# EAGLE design Decoder16_1 (EAGLE 6.5.0)

## Sheet 1 of 5
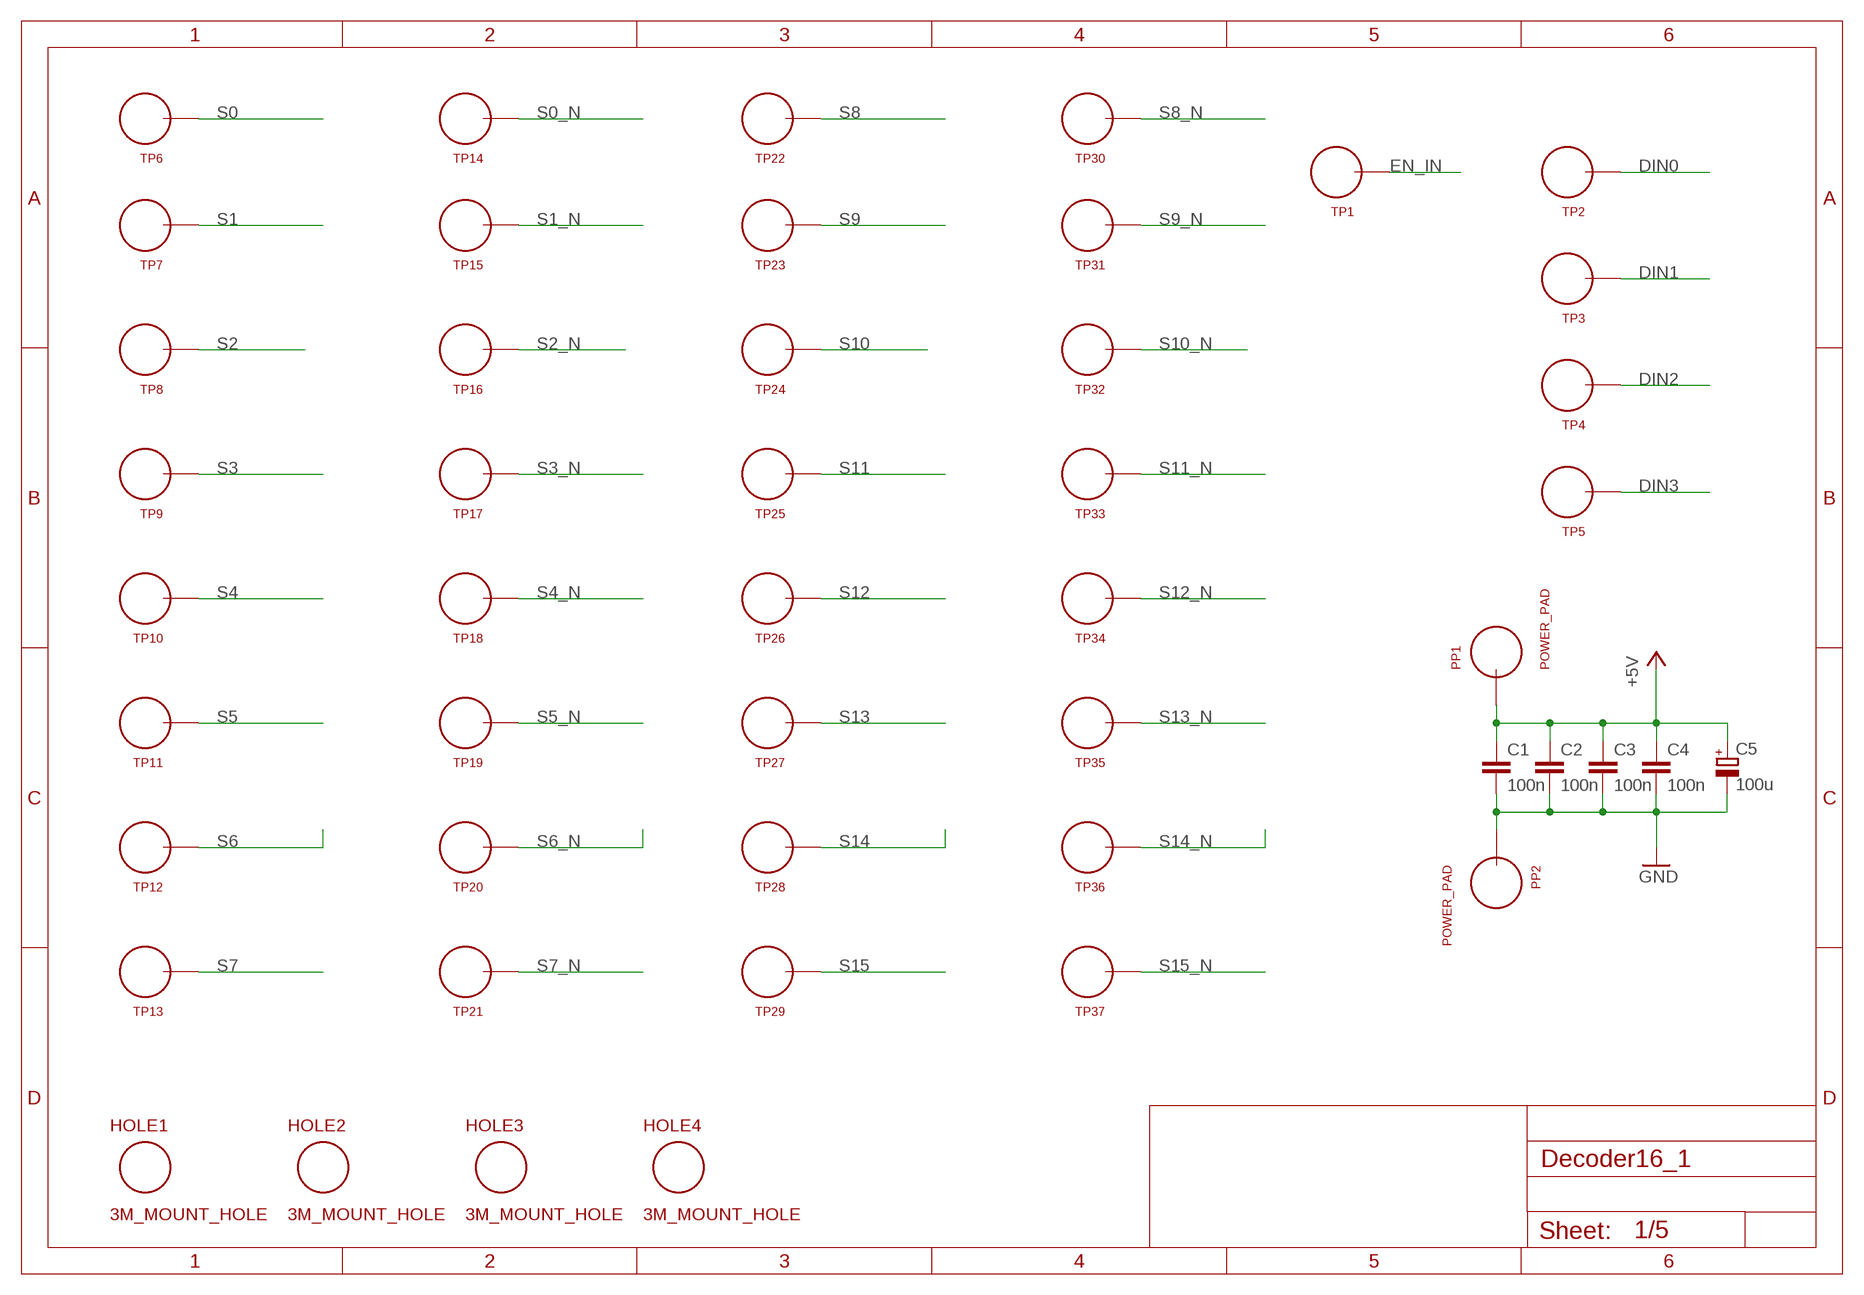
[diagram p0: schematic, sheet 1]

### Parts
C1  100n  C_P2INCH  [CAP_P2INCH]
C2  100n  C_P2INCH  [CAP_P2INCH]
C3  100n  C_P2INCH  [CAP_P2INCH]
C4  100n  C_P2INCH  [CAP_P2INCH]
C5  100u  POLARISED_CAP_2P5_6P3MM  [POLARISED_CAP_2P5_6P3MM]
HOLE1  3M_MOUNT_HOLE  [3M_HOLE]
HOLE2  3M_MOUNT_HOLE  [3M_HOLE]
HOLE3  3M_MOUNT_HOLE  [3M_HOLE]
HOLE4  3M_MOUNT_HOLE  [3M_HOLE]
PP1  POWER_PAD  [POWER_PAD]
PP2  POWER_PAD  [POWER_PAD]
TP1  TEST_LOOP  [TEST_LOOP]
TP2  TEST_LOOP  [TEST_LOOP]
TP3  TEST_LOOP  [TEST_LOOP]
TP4  TEST_LOOP  [TEST_LOOP]
TP5  TEST_LOOP  [TEST_LOOP]
TP6  TEST_LOOP  [TEST_LOOP]
TP7  TEST_LOOP  [TEST_LOOP]
TP8  TEST_LOOP  [TEST_LOOP]
TP9  TEST_LOOP  [TEST_LOOP]
TP10  TEST_LOOP  [TEST_LOOP]
TP11  TEST_LOOP  [TEST_LOOP]
TP12  TEST_LOOP  [TEST_LOOP]
TP13  TEST_LOOP  [TEST_LOOP]
TP14  TEST_LOOP  [TEST_LOOP]
TP15  TEST_LOOP  [TEST_LOOP]
TP16  TEST_LOOP  [TEST_LOOP]
TP17  TEST_LOOP  [TEST_LOOP]
TP18  TEST_LOOP  [TEST_LOOP]
TP19  TEST_LOOP  [TEST_LOOP]
TP20  TEST_LOOP  [TEST_LOOP]
TP21  TEST_LOOP  [TEST_LOOP]
TP22  TEST_LOOP  [TEST_LOOP]
TP23  TEST_LOOP  [TEST_LOOP]
TP24  TEST_LOOP  [TEST_LOOP]
TP25  TEST_LOOP  [TEST_LOOP]
TP26  TEST_LOOP  [TEST_LOOP]
TP27  TEST_LOOP  [TEST_LOOP]
TP28  TEST_LOOP  [TEST_LOOP]
TP29  TEST_LOOP  [TEST_LOOP]
TP30  TEST_LOOP  [TEST_LOOP]
TP31  TEST_LOOP  [TEST_LOOP]
TP32  TEST_LOOP  [TEST_LOOP]
TP33  TEST_LOOP  [TEST_LOOP]
TP34  TEST_LOOP  [TEST_LOOP]
TP35  TEST_LOOP  [TEST_LOOP]
TP36  TEST_LOOP  [TEST_LOOP]
TP37  TEST_LOOP  [TEST_LOOP]

### Nets
+5V: C1.1 C2.1 C3.1 C4.1 C5.A PP1.1 ; also sheet 2,3,4,5
DIN0: TP2.P$1 ; also sheet 2
DIN1: TP3.P$1 ; also sheet 2
DIN2: TP4.P$1 ; also sheet 2
DIN3: TP5.P$1 ; also sheet 2
EN_IN: TP1.P$1 ; also sheet 2
GND: C1.2 C2.2 C3.2 C4.2 C5.K PP2.1 ; also sheet 2,3,4,5
S0: TP6.P$1 ; also sheet 5
S0_N: TP14.P$1 ; also sheet 3,5
S1: TP7.P$1 ; also sheet 5
S1_N: TP15.P$1 ; also sheet 3,5
S2: TP8.P$1 ; also sheet 5
S2_N: TP16.P$1 ; also sheet 3,5
S3: TP9.P$1 ; also sheet 5
S3_N: TP17.P$1 ; also sheet 3,5
S4: TP10.P$1 ; also sheet 5
S4_N: TP18.P$1 ; also sheet 3,5
S5: TP11.P$1 ; also sheet 5
S5_N: TP19.P$1 ; also sheet 3,5
S6: TP12.P$1 ; also sheet 5
S6_N: TP20.P$1 ; also sheet 3,5
S7: TP13.P$1 ; also sheet 5
S7_N: TP21.P$1 ; also sheet 3,5
S8: TP22.P$1 ; also sheet 5
S8_N: TP30.P$1 ; also sheet 4,5
S9: TP23.P$1 ; also sheet 5
S9_N: TP31.P$1 ; also sheet 4,5
S10: TP24.P$1 ; also sheet 5
S10_N: TP32.P$1 ; also sheet 4,5
S11: TP25.P$1 ; also sheet 5
S11_N: TP33.P$1 ; also sheet 4,5
S12: TP26.P$1 ; also sheet 5
S12_N: TP34.P$1 ; also sheet 4,5
S13: TP27.P$1 ; also sheet 5
S13_N: TP35.P$1 ; also sheet 4,5
S14: TP28.P$1 ; also sheet 5
S14_N: TP36.P$1 ; also sheet 4,5
S15: TP29.P$1 ; also sheet 5
S15_N: TP37.P$1 ; also sheet 4,5

## Sheet 2 of 5
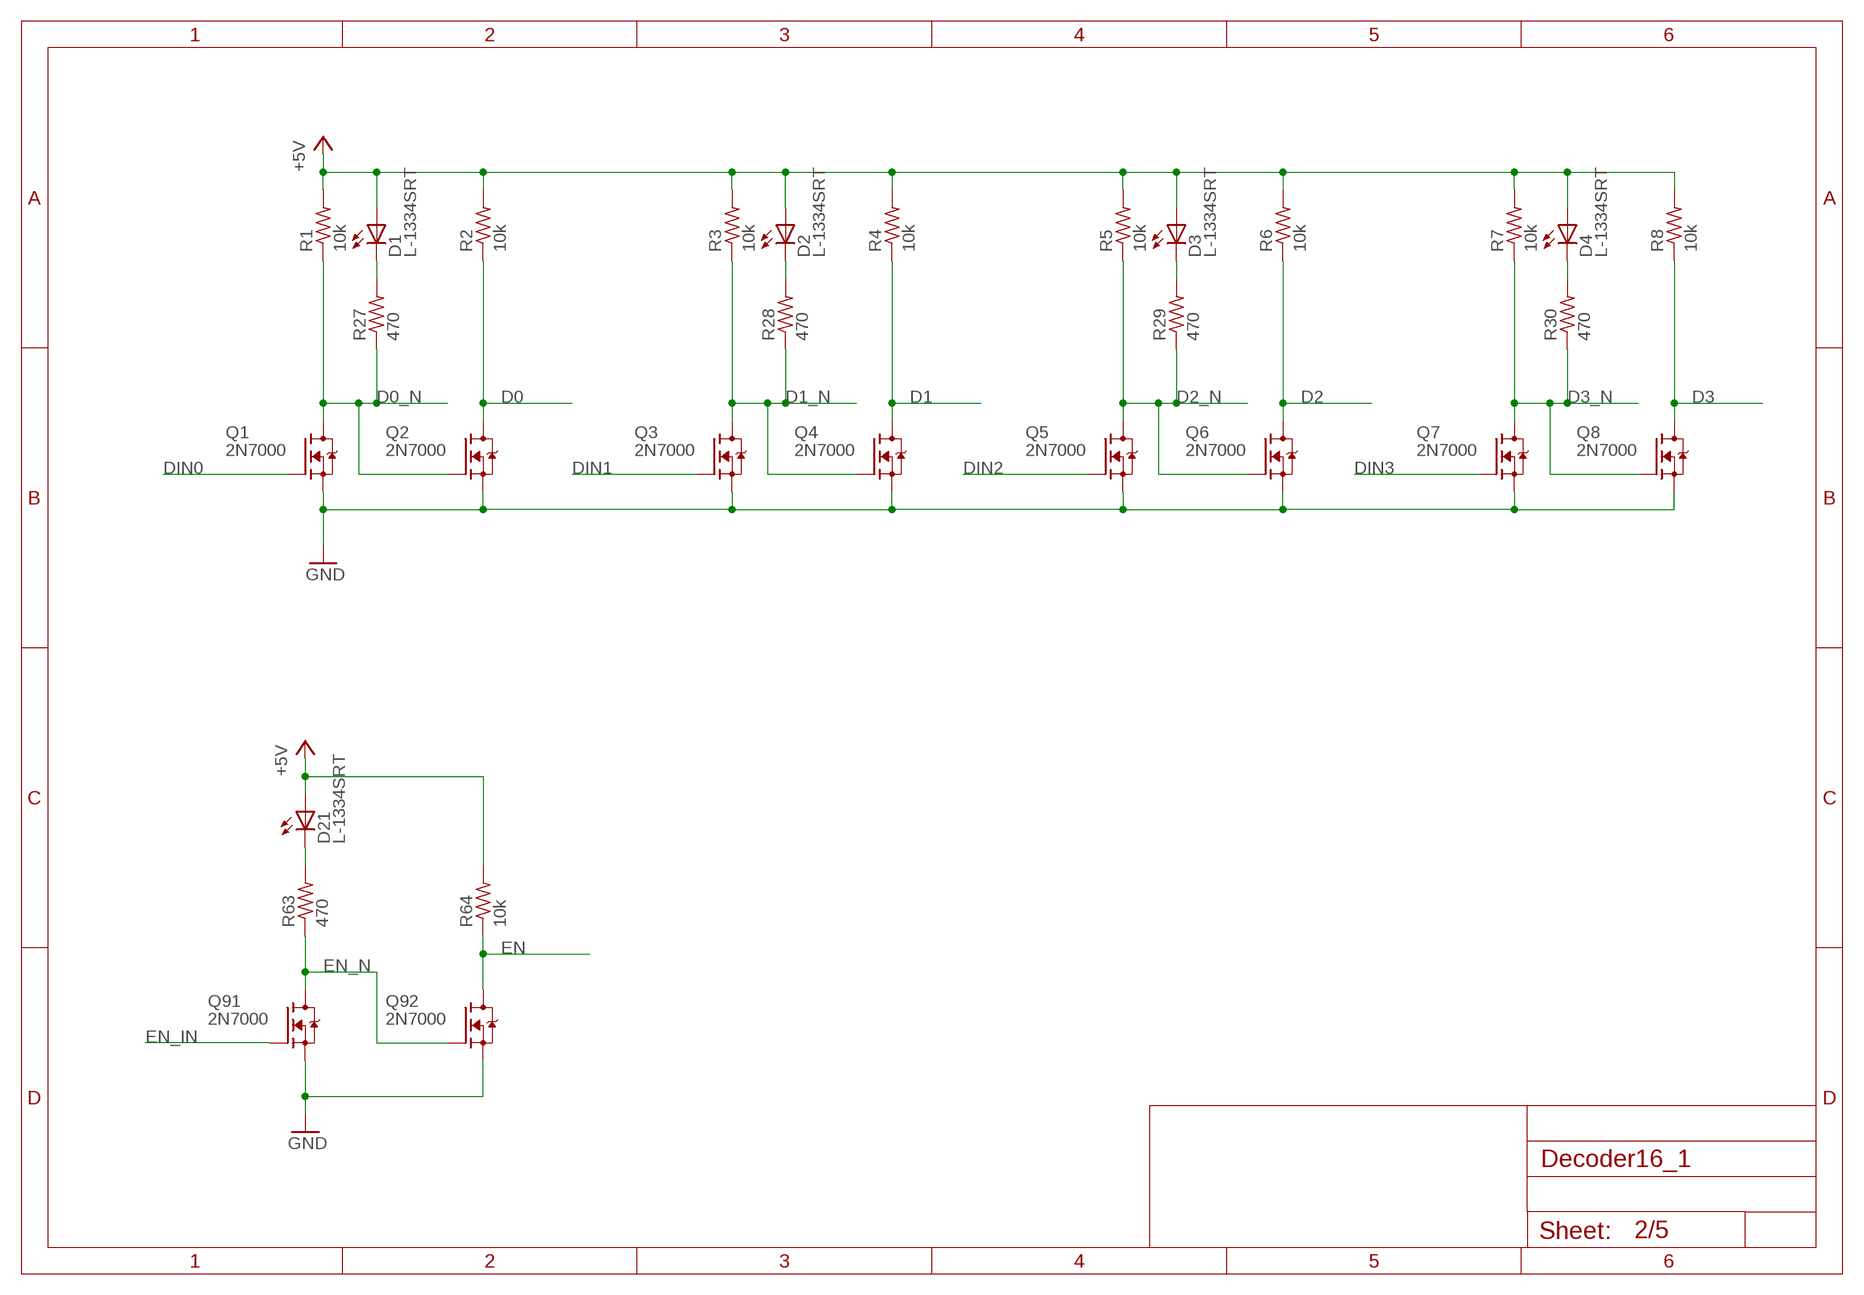
[diagram p1: schematic, sheet 2]

### Parts
D1  L-1334SRT  [LED3MM]
D2  L-1334SRT  [LED3MM]
D3  L-1334SRT  [LED3MM]
D4  L-1334SRT  [LED3MM]
D21  L-1334SRT  [LED3MM]
Q1  2N7000  [TO92-DGS]
Q2  2N7000  [TO92-DGS]
Q3  2N7000  [TO92-DGS]
Q4  2N7000  [TO92-DGS]
Q5  2N7000  [TO92-DGS]
Q6  2N7000  [TO92-DGS]
Q7  2N7000  [TO92-DGS]
Q8  2N7000  [TO92-DGS]
Q91  2N7000  [TO92-DGS]
Q92  2N7000  [TO92-DGS]
R1  10k  R_P2INCH  [R_P2INCH]
R2  10k  R_P2INCH  [R_P2INCH]
R3  10k  R_P2INCH  [R_P2INCH]
R4  10k  R_P2INCH  [R_P2INCH]
R5  10k  R_P2INCH  [R_P2INCH]
R6  10k  R_P2INCH  [R_P2INCH]
R7  10k  R_P2INCH  [R_P2INCH]
R8  10k  R_P2INCH  [R_P2INCH]
R27  470  R_P2INCH  [R_P2INCH]
R28  470  R_P2INCH  [R_P2INCH]
R29  470  R_P2INCH  [R_P2INCH]
R30  470  R_P2INCH  [R_P2INCH]
R63  470  R_P2INCH  [R_P2INCH]
R64  10k  R_P2INCH  [R_P2INCH]

### Nets
+5V: D1.A D2.A D3.A D4.A D21.A R1.2 R2.2 R3.2 R4.2 R5.2 R6.2 R7.2 R8.2 R64.2 ; also sheet 1,3,4,5
D0: Q2.D R2.1 ; also sheet 3,4
D0_N: Q1.D Q2.G R1.1 R27.1 ; also sheet 3,4
D1: Q4.D R4.1 ; also sheet 3,4
D1_N: Q3.D Q4.G R3.1 R28.1 ; also sheet 3,4
D2: Q6.D R6.1 ; also sheet 3,4
D2_N: Q5.D Q6.G R5.1 R29.1 ; also sheet 3,4
D3: Q8.D R8.1 ; also sheet 4
D3_N: Q7.D Q8.G R7.1 R30.1 ; also sheet 3
DIN0: Q1.G ; also sheet 1
DIN1: Q3.G ; also sheet 1
DIN2: Q5.G ; also sheet 1
DIN3: Q7.G ; also sheet 1
EN: Q92.D R64.1 ; also sheet 3,4
EN_IN: Q91.G ; also sheet 1
EN_N: Q91.D Q92.G R63.1
GND: Q1.S Q2.S Q3.S Q4.S Q5.S Q6.S Q7.S Q8.S Q91.S Q92.S ; also sheet 1,3,4,5
N$51: D1.K(C) R27.2
N$52: D2.K(C) R28.2
N$53: D3.K(C) R29.2
N$54: D4.K(C) R30.2
N$71: D21.K(C) R63.2

## Sheet 3 of 5
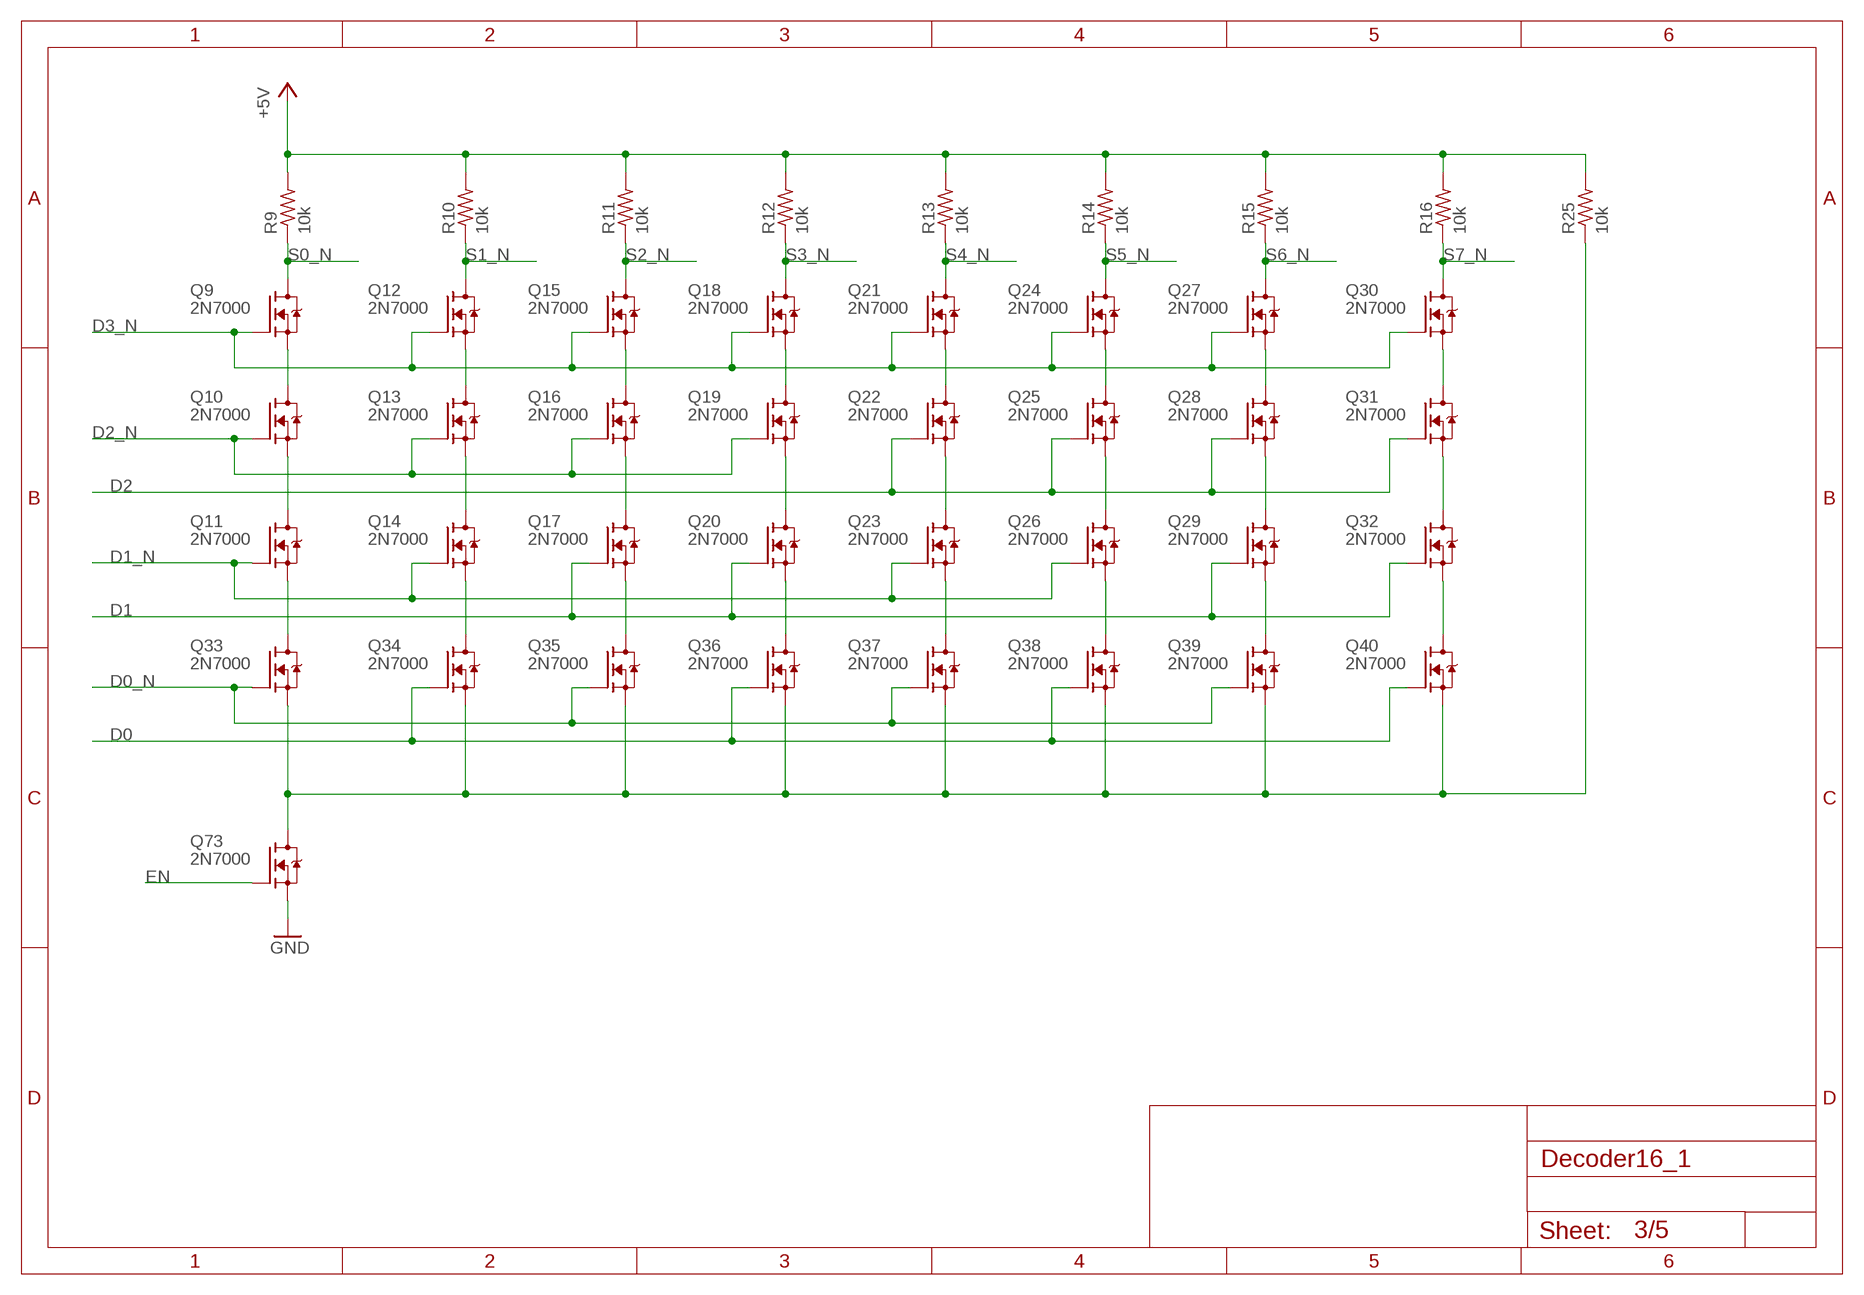
[diagram p2: schematic, sheet 3]

### Parts
Q9  2N7000  [TO92-DGS]
Q10  2N7000  [TO92-DGS]
Q11  2N7000  [TO92-DGS]
Q12  2N7000  [TO92-DGS]
Q13  2N7000  [TO92-DGS]
Q14  2N7000  [TO92-DGS]
Q15  2N7000  [TO92-DGS]
Q16  2N7000  [TO92-DGS]
Q17  2N7000  [TO92-DGS]
Q18  2N7000  [TO92-DGS]
Q19  2N7000  [TO92-DGS]
Q20  2N7000  [TO92-DGS]
Q21  2N7000  [TO92-DGS]
Q22  2N7000  [TO92-DGS]
Q23  2N7000  [TO92-DGS]
Q24  2N7000  [TO92-DGS]
Q25  2N7000  [TO92-DGS]
Q26  2N7000  [TO92-DGS]
Q27  2N7000  [TO92-DGS]
Q28  2N7000  [TO92-DGS]
Q29  2N7000  [TO92-DGS]
Q30  2N7000  [TO92-DGS]
Q31  2N7000  [TO92-DGS]
Q32  2N7000  [TO92-DGS]
Q33  2N7000  [TO92-DGS]
Q34  2N7000  [TO92-DGS]
Q35  2N7000  [TO92-DGS]
Q36  2N7000  [TO92-DGS]
Q37  2N7000  [TO92-DGS]
Q38  2N7000  [TO92-DGS]
Q39  2N7000  [TO92-DGS]
Q40  2N7000  [TO92-DGS]
Q73  2N7000  [TO92-DGS]
R9  10k  R_P2INCH  [R_P2INCH]
R10  10k  R_P2INCH  [R_P2INCH]
R11  10k  R_P2INCH  [R_P2INCH]
R12  10k  R_P2INCH  [R_P2INCH]
R13  10k  R_P2INCH  [R_P2INCH]
R14  10k  R_P2INCH  [R_P2INCH]
R15  10k  R_P2INCH  [R_P2INCH]
R16  10k  R_P2INCH  [R_P2INCH]
R25  10k  R_P2INCH  [R_P2INCH]

### Nets
+5V: R9.2 R10.2 R11.2 R12.2 R13.2 R14.2 R15.2 R16.2 R25.2 ; also sheet 1,2,4,5
D0: Q34.G Q36.G Q38.G Q40.G ; also sheet 2,4
D0_N: Q33.G Q35.G Q37.G Q39.G ; also sheet 2,4
D1: Q17.G Q20.G Q29.G Q32.G ; also sheet 2,4
D1_N: Q11.G Q14.G Q23.G Q26.G ; also sheet 2,4
D2: Q22.G Q25.G Q28.G Q31.G ; also sheet 2,4
D2_N: Q10.G Q13.G Q16.G Q19.G ; also sheet 2,4
D3_N: Q9.G Q12.G Q15.G Q18.G Q21.G Q24.G Q27.G Q30.G ; also sheet 2
EN: Q73.G ; also sheet 2,4
GND: Q73.S ; also sheet 1,2,4,5
N$2: Q9.S Q10.D
N$3: Q10.S Q11.D
N$4: Q12.S Q13.D
N$5: Q13.S Q14.D
N$6: Q15.S Q16.D
N$7: Q16.S Q17.D
N$8: Q18.S Q19.D
N$9: Q19.S Q20.D
N$10: Q21.S Q22.D
N$11: Q22.S Q23.D
N$12: Q24.S Q25.D
N$13: Q25.S Q26.D
N$14: Q27.S Q28.D
N$15: Q28.S Q29.D
N$16: Q30.S Q31.D
N$17: Q31.S Q32.D
N$19: Q11.S Q33.D
N$21: Q14.S Q34.D
N$22: Q17.S Q35.D
N$23: Q20.S Q36.D
N$24: Q23.S Q37.D
N$25: Q26.S Q38.D
N$26: Q29.S Q39.D
N$27: Q32.S Q40.D
N$49: Q33.S Q34.S Q35.S Q36.S Q37.S Q38.S Q39.S Q40.S Q73.D R25.1
S0_N: Q9.D R9.1 ; also sheet 1,5
S1_N: Q12.D R10.1 ; also sheet 1,5
S2_N: Q15.D R11.1 ; also sheet 1,5
S3_N: Q18.D R12.1 ; also sheet 1,5
S4_N: Q21.D R13.1 ; also sheet 1,5
S5_N: Q24.D R14.1 ; also sheet 1,5
S6_N: Q27.D R15.1 ; also sheet 1,5
S7_N: Q30.D R16.1 ; also sheet 1,5

## Sheet 4 of 5
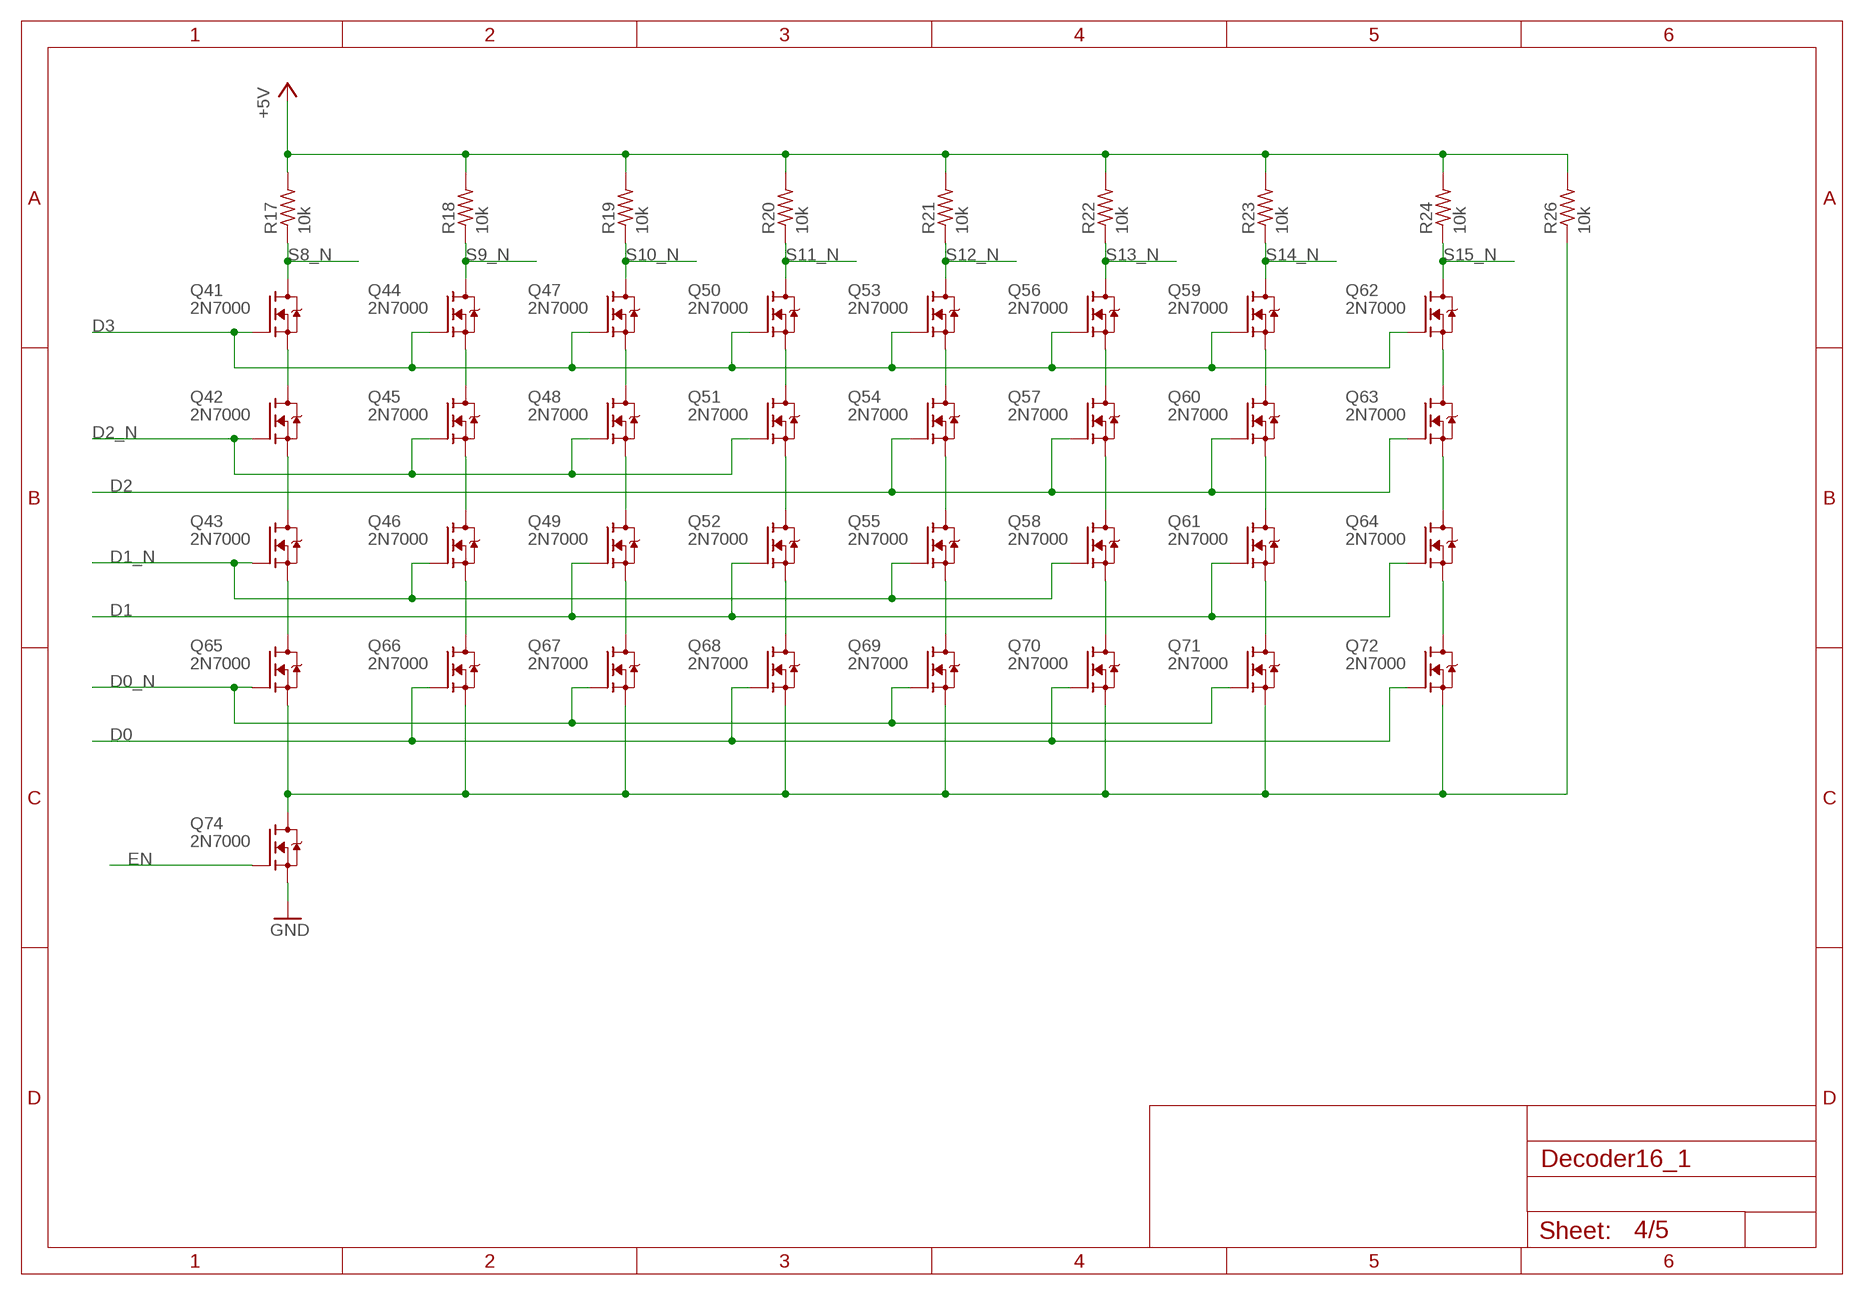
[diagram p3: schematic, sheet 4]

### Parts
Q41  2N7000  [TO92-DGS]
Q42  2N7000  [TO92-DGS]
Q43  2N7000  [TO92-DGS]
Q44  2N7000  [TO92-DGS]
Q45  2N7000  [TO92-DGS]
Q46  2N7000  [TO92-DGS]
Q47  2N7000  [TO92-DGS]
Q48  2N7000  [TO92-DGS]
Q49  2N7000  [TO92-DGS]
Q50  2N7000  [TO92-DGS]
Q51  2N7000  [TO92-DGS]
Q52  2N7000  [TO92-DGS]
Q53  2N7000  [TO92-DGS]
Q54  2N7000  [TO92-DGS]
Q55  2N7000  [TO92-DGS]
Q56  2N7000  [TO92-DGS]
Q57  2N7000  [TO92-DGS]
Q58  2N7000  [TO92-DGS]
Q59  2N7000  [TO92-DGS]
Q60  2N7000  [TO92-DGS]
Q61  2N7000  [TO92-DGS]
Q62  2N7000  [TO92-DGS]
Q63  2N7000  [TO92-DGS]
Q64  2N7000  [TO92-DGS]
Q65  2N7000  [TO92-DGS]
Q66  2N7000  [TO92-DGS]
Q67  2N7000  [TO92-DGS]
Q68  2N7000  [TO92-DGS]
Q69  2N7000  [TO92-DGS]
Q70  2N7000  [TO92-DGS]
Q71  2N7000  [TO92-DGS]
Q72  2N7000  [TO92-DGS]
Q74  2N7000  [TO92-DGS]
R17  10k  R_P2INCH  [R_P2INCH]
R18  10k  R_P2INCH  [R_P2INCH]
R19  10k  R_P2INCH  [R_P2INCH]
R20  10k  R_P2INCH  [R_P2INCH]
R21  10k  R_P2INCH  [R_P2INCH]
R22  10k  R_P2INCH  [R_P2INCH]
R23  10k  R_P2INCH  [R_P2INCH]
R24  10k  R_P2INCH  [R_P2INCH]
R26  10k  R_P2INCH  [R_P2INCH]

### Nets
+5V: R17.2 R18.2 R19.2 R20.2 R21.2 R22.2 R23.2 R24.2 R26.2 ; also sheet 1,2,3,5
D0: Q66.G Q68.G Q70.G Q72.G ; also sheet 2,3
D0_N: Q65.G Q67.G Q69.G Q71.G ; also sheet 2,3
D1: Q49.G Q52.G Q61.G Q64.G ; also sheet 2,3
D1_N: Q43.G Q46.G Q55.G Q58.G ; also sheet 2,3
D2: Q54.G Q57.G Q60.G Q63.G ; also sheet 2,3
D2_N: Q42.G Q45.G Q48.G Q51.G ; also sheet 2,3
D3: Q41.G Q44.G Q47.G Q50.G Q53.G Q56.G Q59.G Q62.G ; also sheet 2
EN: Q74.G ; also sheet 2,3
GND: Q74.S ; also sheet 1,2,3,5
N$1: Q41.S Q42.D
N$18: Q42.S Q43.D
N$20: Q44.S Q45.D
N$28: Q45.S Q46.D
N$29: Q47.S Q48.D
N$30: Q48.S Q49.D
N$31: Q50.S Q51.D
N$32: Q51.S Q52.D
N$33: Q53.S Q54.D
N$34: Q54.S Q55.D
N$35: Q56.S Q57.D
N$36: Q57.S Q58.D
N$37: Q59.S Q60.D
N$38: Q60.S Q61.D
N$39: Q62.S Q63.D
N$40: Q63.S Q64.D
N$41: Q43.S Q65.D
N$42: Q46.S Q66.D
N$43: Q49.S Q67.D
N$44: Q52.S Q68.D
N$45: Q55.S Q69.D
N$46: Q58.S Q70.D
N$47: Q61.S Q71.D
N$48: Q64.S Q72.D
N$50: Q65.S Q66.S Q67.S Q68.S Q69.S Q70.S Q71.S Q72.S Q74.D R26.1
S8_N: Q41.D R17.1 ; also sheet 1,5
S9_N: Q44.D R18.1 ; also sheet 1,5
S10_N: Q47.D R19.1 ; also sheet 1,5
S11_N: Q50.D R20.1 ; also sheet 1,5
S12_N: Q53.D R21.1 ; also sheet 1,5
S13_N: Q56.D R22.1 ; also sheet 1,5
S14_N: Q59.D R23.1 ; also sheet 1,5
S15_N: Q62.D R24.1 ; also sheet 1,5

## Sheet 5 of 5
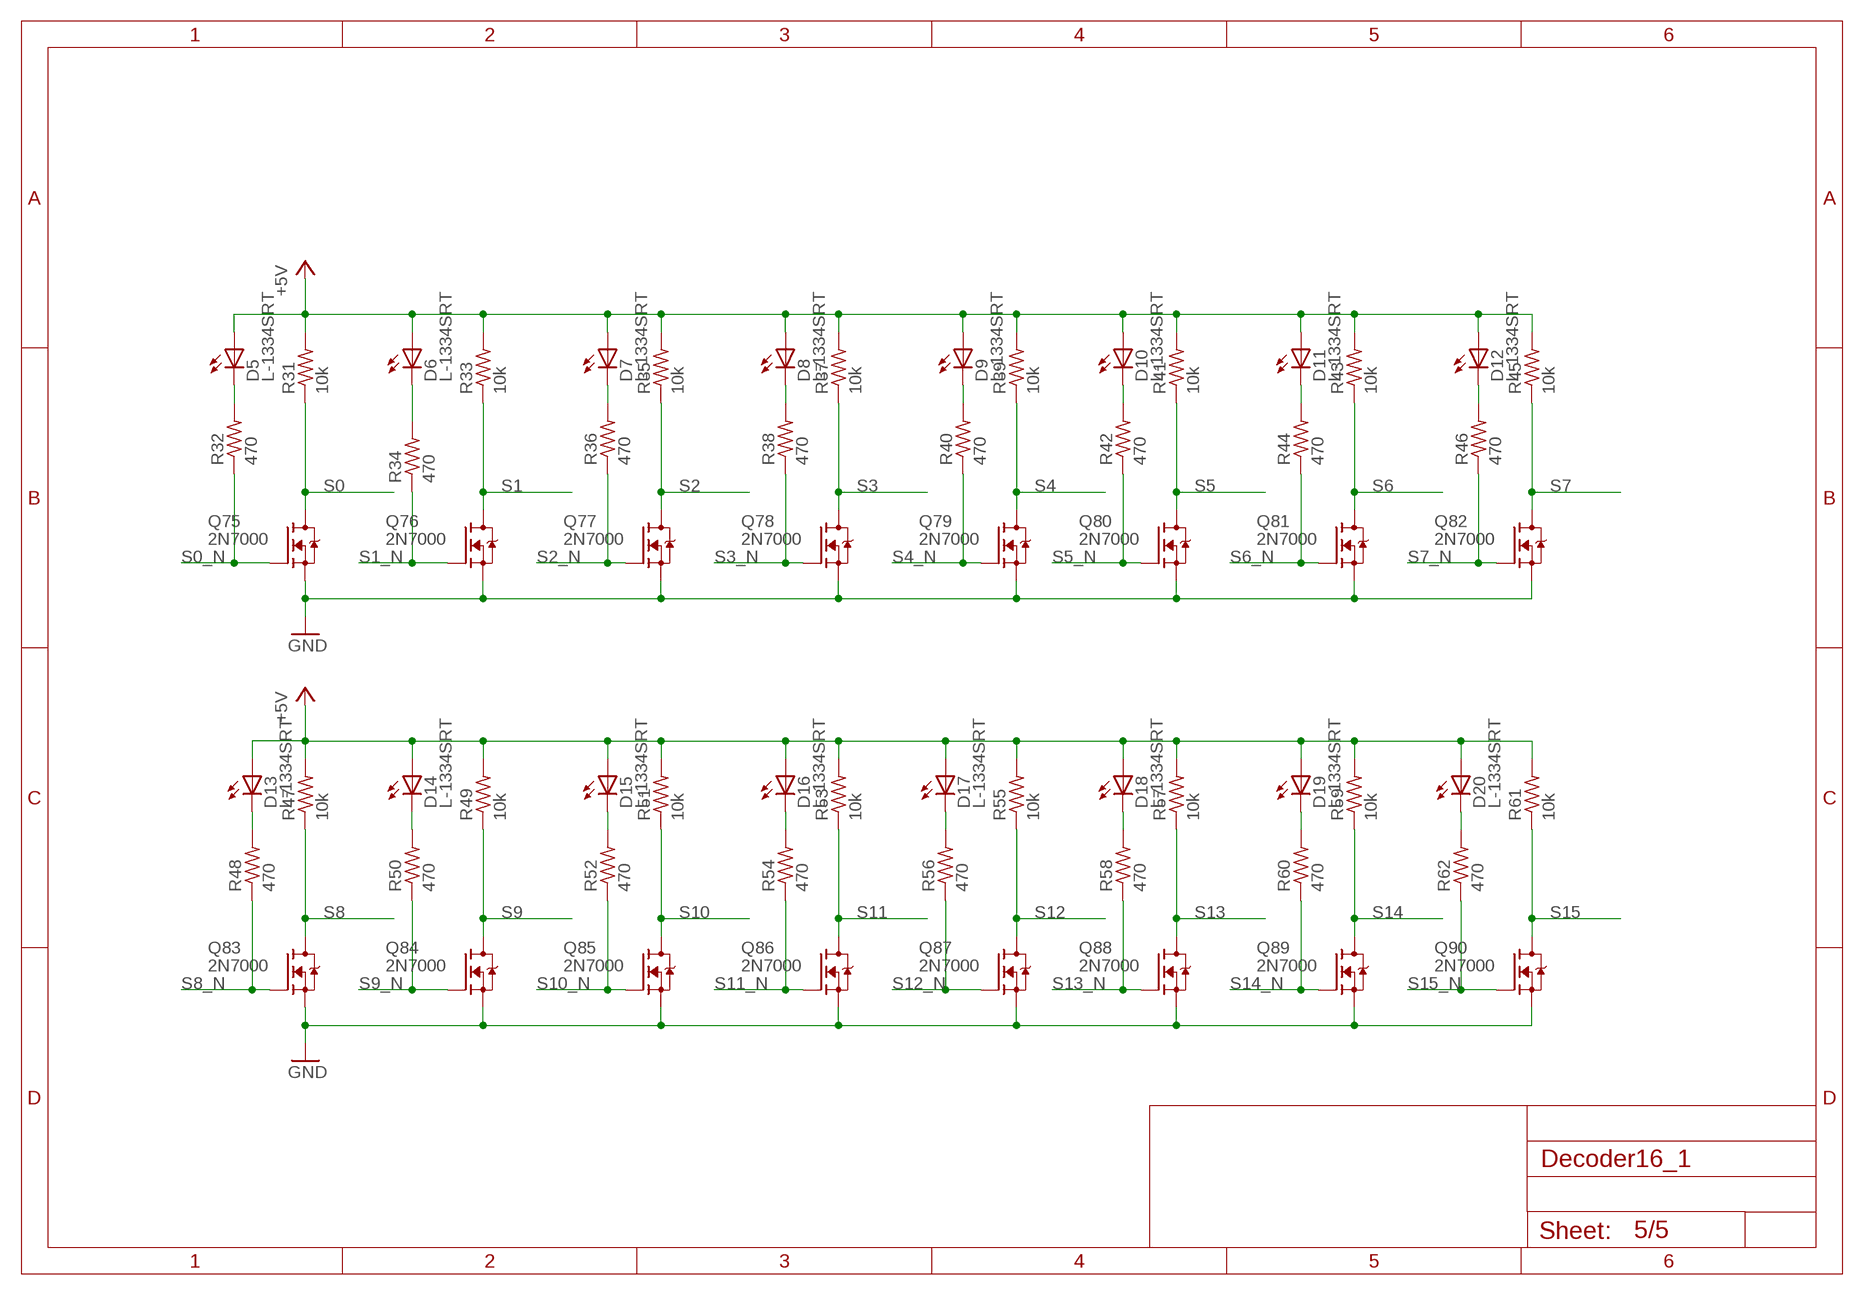
[diagram p4: schematic, sheet 5]

### Parts
D5  L-1334SRT  [LED3MM]
D6  L-1334SRT  [LED3MM]
D7  L-1334SRT  [LED3MM]
D8  L-1334SRT  [LED3MM]
D9  L-1334SRT  [LED3MM]
D10  L-1334SRT  [LED3MM]
D11  L-1334SRT  [LED3MM]
D12  L-1334SRT  [LED3MM]
D13  L-1334SRT  [LED3MM]
D14  L-1334SRT  [LED3MM]
D15  L-1334SRT  [LED3MM]
D16  L-1334SRT  [LED3MM]
D17  L-1334SRT  [LED3MM]
D18  L-1334SRT  [LED3MM]
D19  L-1334SRT  [LED3MM]
D20  L-1334SRT  [LED3MM]
Q75  2N7000  [TO92-DGS]
Q76  2N7000  [TO92-DGS]
Q77  2N7000  [TO92-DGS]
Q78  2N7000  [TO92-DGS]
Q79  2N7000  [TO92-DGS]
Q80  2N7000  [TO92-DGS]
Q81  2N7000  [TO92-DGS]
Q82  2N7000  [TO92-DGS]
Q83  2N7000  [TO92-DGS]
Q84  2N7000  [TO92-DGS]
Q85  2N7000  [TO92-DGS]
Q86  2N7000  [TO92-DGS]
Q87  2N7000  [TO92-DGS]
Q88  2N7000  [TO92-DGS]
Q89  2N7000  [TO92-DGS]
Q90  2N7000  [TO92-DGS]
R31  10k  R_P2INCH  [R_P2INCH]
R32  470  R_P2INCH  [R_P2INCH]
R33  10k  R_P2INCH  [R_P2INCH]
R34  470  R_P2INCH  [R_P2INCH]
R35  10k  R_P2INCH  [R_P2INCH]
R36  470  R_P2INCH  [R_P2INCH]
R37  10k  R_P2INCH  [R_P2INCH]
R38  470  R_P2INCH  [R_P2INCH]
R39  10k  R_P2INCH  [R_P2INCH]
R40  470  R_P2INCH  [R_P2INCH]
R41  10k  R_P2INCH  [R_P2INCH]
R42  470  R_P2INCH  [R_P2INCH]
R43  10k  R_P2INCH  [R_P2INCH]
R44  470  R_P2INCH  [R_P2INCH]
R45  10k  R_P2INCH  [R_P2INCH]
R46  470  R_P2INCH  [R_P2INCH]
R47  10k  R_P2INCH  [R_P2INCH]
R48  470  R_P2INCH  [R_P2INCH]
R49  10k  R_P2INCH  [R_P2INCH]
R50  470  R_P2INCH  [R_P2INCH]
R51  10k  R_P2INCH  [R_P2INCH]
R52  470  R_P2INCH  [R_P2INCH]
R53  10k  R_P2INCH  [R_P2INCH]
R54  470  R_P2INCH  [R_P2INCH]
R55  10k  R_P2INCH  [R_P2INCH]
R56  470  R_P2INCH  [R_P2INCH]
R57  10k  R_P2INCH  [R_P2INCH]
R58  470  R_P2INCH  [R_P2INCH]
R59  10k  R_P2INCH  [R_P2INCH]
R60  470  R_P2INCH  [R_P2INCH]
R61  10k  R_P2INCH  [R_P2INCH]
R62  470  R_P2INCH  [R_P2INCH]

### Nets
+5V: D5.A D6.A D7.A D8.A D9.A D10.A D11.A D12.A D13.A D14.A D15.A D16.A D17.A D18.A D19.A D20.A R31.2 R33.2 R35.2 R37.2 R39.2 R41.2 R43.2 R45.2 R47.2 R49.2 R51.2 R53.2 R55.2 R57.2 R59.2 R61.2 ; also sheet 1,2,3,4
GND: Q75.S Q76.S Q77.S Q78.S Q79.S Q80.S Q81.S Q82.S Q83.S Q84.S Q85.S Q86.S Q87.S Q88.S Q89.S Q90.S ; also sheet 1,2,3,4
N$55: D5.K(C) R32.2
N$56: D13.K(C) R48.2
N$57: D6.K(C) R34.2
N$58: D14.K(C) R50.2
N$59: D7.K(C) R36.2
N$60: D15.K(C) R52.2
N$61: D8.K(C) R38.2
N$62: D16.K(C) R54.2
N$63: D9.K(C) R40.2
N$64: D17.K(C) R56.2
N$65: D10.K(C) R42.2
N$66: D18.K(C) R58.2
N$67: D11.K(C) R44.2
N$68: D19.K(C) R60.2
N$69: D12.K(C) R46.2
N$70: D20.K(C) R62.2
S0: Q75.D R31.1 ; also sheet 1
S0_N: Q75.G R32.1 ; also sheet 1,3
S1: Q76.D R33.1 ; also sheet 1
S1_N: Q76.G R34.1 ; also sheet 1,3
S2: Q77.D R35.1 ; also sheet 1
S2_N: Q77.G R36.1 ; also sheet 1,3
S3: Q78.D R37.1 ; also sheet 1
S3_N: Q78.G R38.1 ; also sheet 1,3
S4: Q79.D R39.1 ; also sheet 1
S4_N: Q79.G R40.1 ; also sheet 1,3
S5: Q80.D R41.1 ; also sheet 1
S5_N: Q80.G R42.1 ; also sheet 1,3
S6: Q81.D R43.1 ; also sheet 1
S6_N: Q81.G R44.1 ; also sheet 1,3
S7: Q82.D R45.1 ; also sheet 1
S7_N: Q82.G R46.1 ; also sheet 1,3
S8: Q83.D R47.1 ; also sheet 1
S8_N: Q83.G R48.1 ; also sheet 1,4
S9: Q84.D R49.1 ; also sheet 1
S9_N: Q84.G R50.1 ; also sheet 1,4
S10: Q85.D R51.1 ; also sheet 1
S10_N: Q85.G R52.1 ; also sheet 1,4
S11: Q86.D R53.1 ; also sheet 1
S11_N: Q86.G R54.1 ; also sheet 1,4
S12: Q87.D R55.1 ; also sheet 1
S12_N: Q87.G R56.1 ; also sheet 1,4
S13: Q88.D R57.1 ; also sheet 1
S13_N: Q88.G R58.1 ; also sheet 1,4
S14: Q89.D R59.1 ; also sheet 1
S14_N: Q89.G R60.1 ; also sheet 1,4
S15: Q90.D R61.1 ; also sheet 1
S15_N: Q90.G R62.1 ; also sheet 1,4

## Library data of the parts
C1-C4 = MyLib:C_P2INCH
C5 = MyLib:POLARISED_CAP_2P5_6P3MM
D1-D21 = MyLib:L-1334SRT
HOLE1-HOLE4 = MyLib:3M_MOUNT_HOLE
PP1 PP2 = MyLib:POWER_PAD
Q1-Q92 = MyLib:2N7000
R1-R64 = MyLib:R_P2INCH
TP1-TP37 = MyLib:TEST_LOOP

## Board
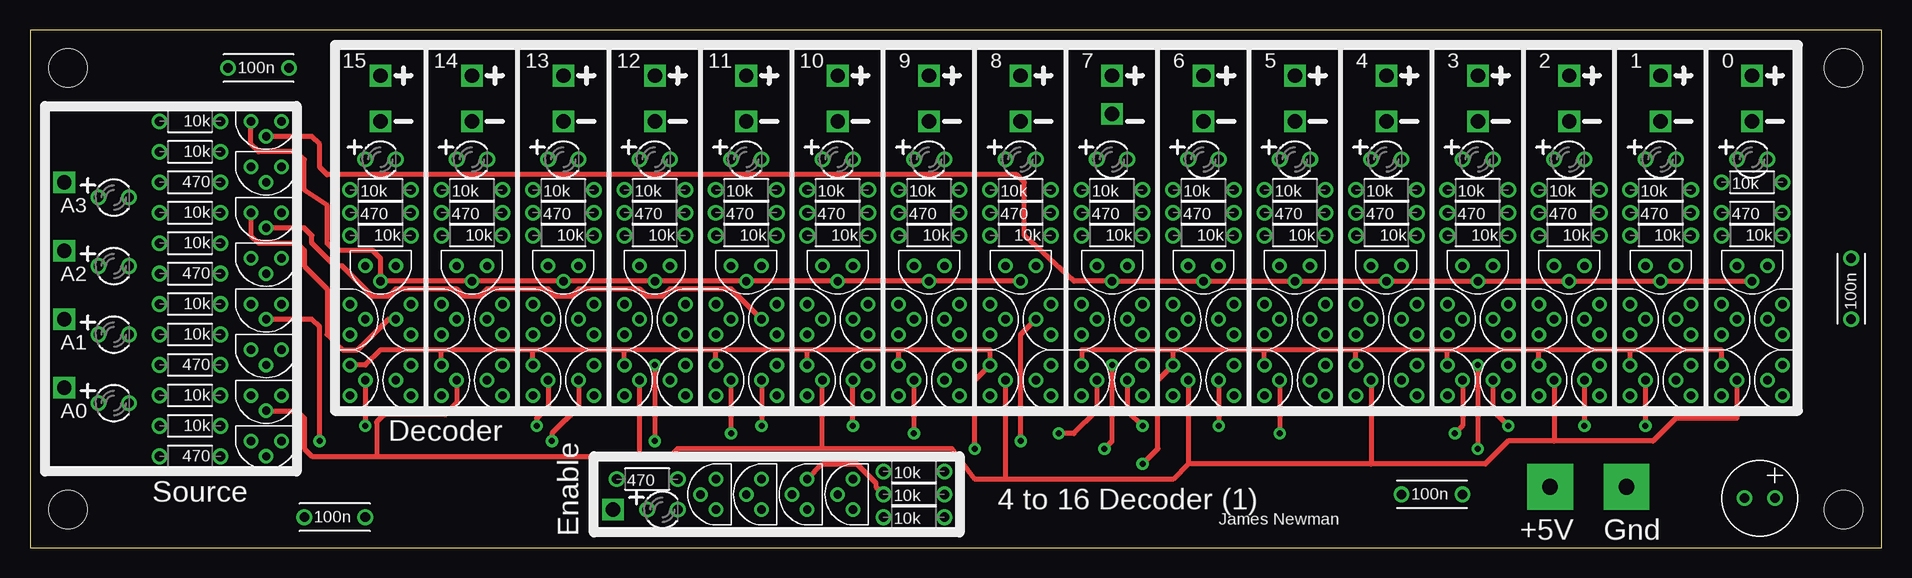
[diagram p5: board, top side]
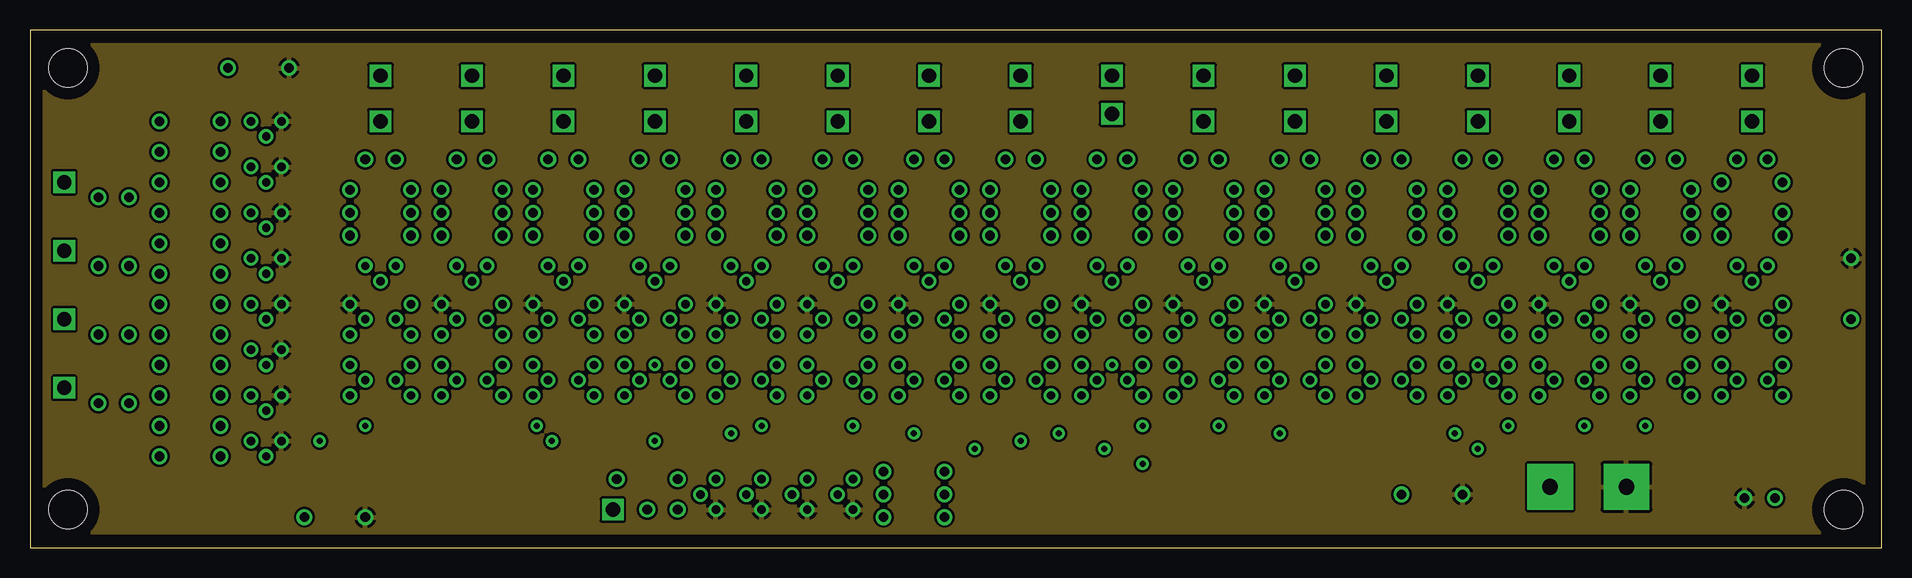
[diagram p6: board, inner layer Route2]
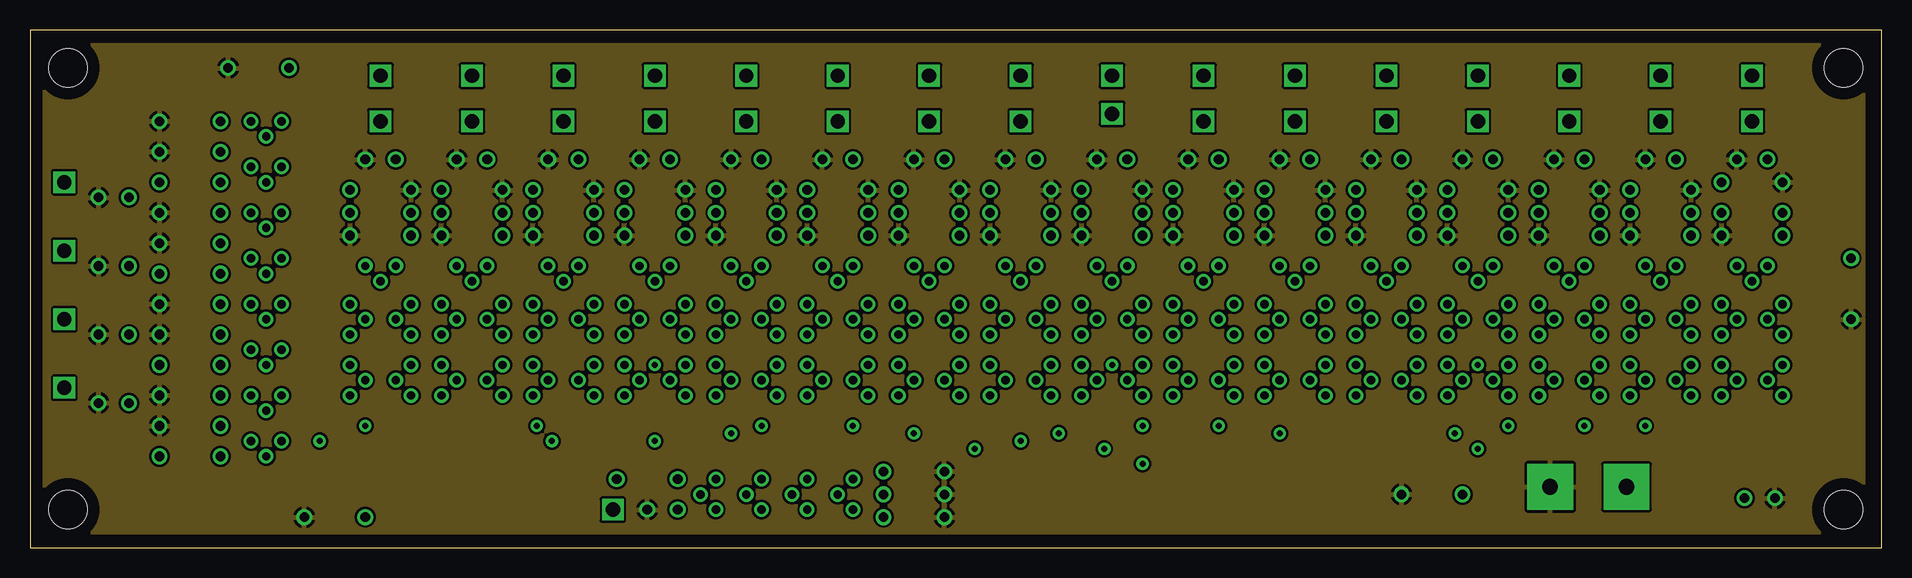
[diagram p7: board, inner layer Route3]
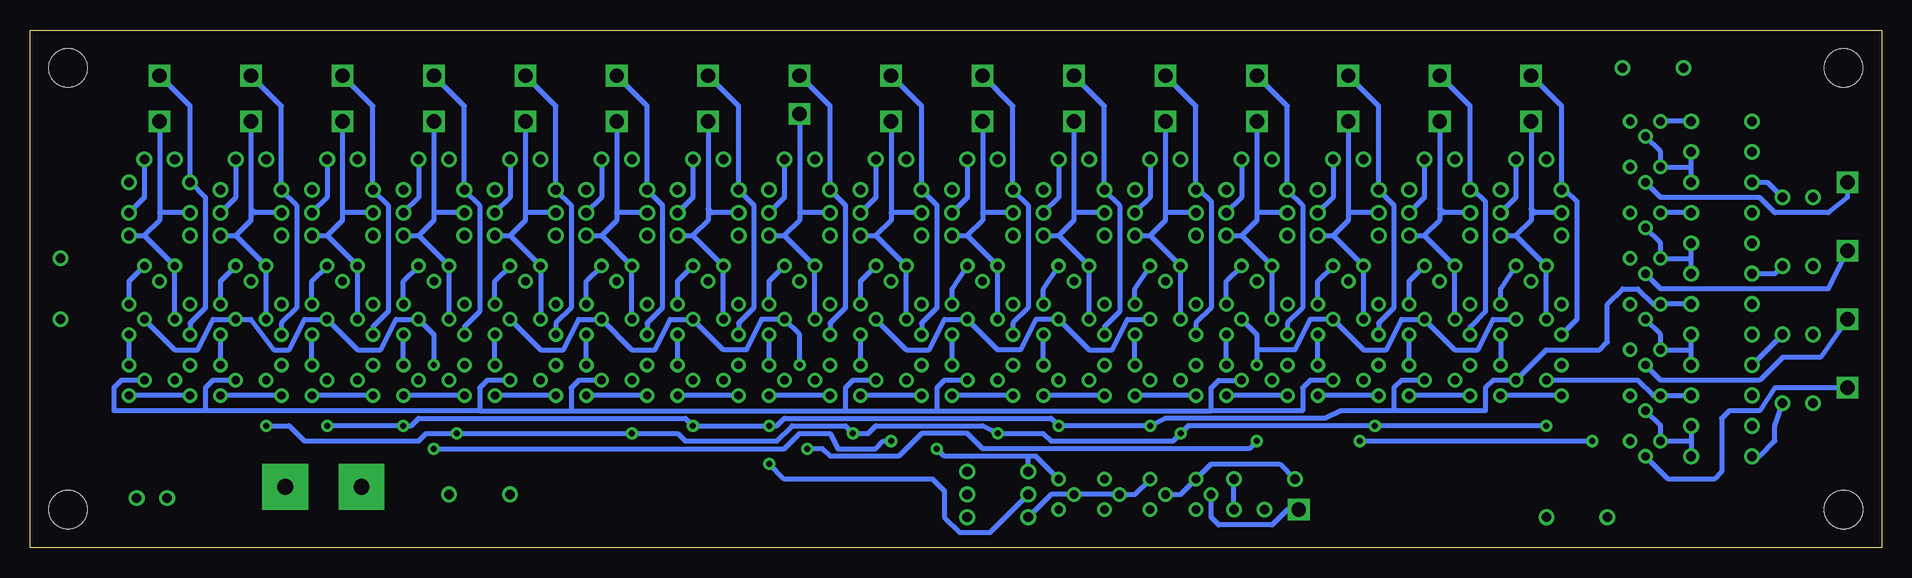
[diagram p8: board, bottom side, seen from below]

Size 154.31 x 43.18 mm. Coordinates in mm from the lower left corner, seen from the top.
Outline: 0,0 154.31,0 154.31,43.18 0,43.18 0,0
Copper layers (1*2+3*16): Top 0.035mm / dielectric 0.2mm / Route2 0.035mm / dielectric 1mm / Route3 0.035mm / dielectric 0.2mm / Bottom 0.035mm
Design rules "processor_rules_4layer": minimum track width 10mil, minimum drill 0.0236mm, track to track 8mil, track to pad 8mil, pad to pad 8mil, via to via 8mil, smd to smd 8mil, copper to edge 40mil, drill to drill 8mil, minimum pad ring 10mil, minimum via ring 8mil, stop-mask expansion 4mil, vias tented up to drill 0.7mm, thermal gap 10mil

### Footprints (pad centres in the part's own frame; a part is rotated, then mirrored left to right if it is on the bottom)
CAP_P2INCH = drill 0.8: 1 -2.54,0; 2 2.54,0
POLARISED_CAP_2P5_6P3MM = drill 0.8: A 1.27,0; K -1.27,0
LED3MM = drill 0.8: A -1.27,0; K 1.27,0
3M_HOLE = hole 3.2: 0,0
POWER_PAD = drill 1.3 pad 3.81 square: 1 0,0
TO92-DGS = drill 0.7: D 0,1.27; G -1.27,0; S 0,-1.27
R_P2INCH = drill 0.8: 1 -2.54,0; 2 2.54,0
TEST_LOOP = drill 1.2 square: P$1 0,0

### Placement (x,y rotation side)
C1  25.4,2.54 0 top
C2  116.84,4.45 0 top
C3  151.76,21.59 90 top
C4  19.05,40.01 0 top
C5  144.15,4.13 0 top
D1  6.99,12.06 0 top
D2  6.99,17.78 0 top
D3  6.99,23.5 0 top
D4  6.99,29.21 0 top
D5  143.51,32.38 0 top
D6  135.89,32.38 0 top
D7  128.27,32.38 0 top
D8  120.65,32.38 0 top
D9  113.03,32.38 0 top
D10  105.41,32.38 0 top
D11  97.79,32.38 0 top
D12  90.17,32.38 0 top
D13  82.55,32.38 0 top
D14  74.93,32.38 0 top
D15  67.31,32.38 0 top
D16  59.69,32.38 0 top
D17  52.07,32.38 0 top
D18  44.45,32.38 0 top
D19  36.83,32.38 0 top
D20  29.21,32.38 0 top
D21  52.7,3.17 0 top
HOLE1  3.17,40.01 0 top
HOLE2  151.13,40.01 0 top
HOLE3  3.17,3.17 0 top
HOLE4  151.13,3.17 0 top
PP1  126.68,5.08 180 top
PP2  133.03,5.08 0 top
Q1  19.68,8.89 90 top
Q2  19.68,12.7 90 top
Q3  19.68,16.51 90 top
Q4  19.68,20.32 90 top
Q5  19.68,24.13 90 top
Q6  19.68,27.94 90 top
Q7  19.68,31.75 90 top
Q8  19.68,35.56 90 top
Q9  143.51,23.5 90 top
Q10  146.05,19.05 0 top
Q11  146.05,13.97 0 top
Q12  135.89,23.5 90 top
Q13  138.43,19.05 0 top
Q14  138.43,13.97 0 top
Q15  128.27,23.5 90 top
Q16  130.81,19.05 0 top
Q17  130.81,13.97 0 top
Q18  120.65,23.5 90 top
Q19  123.19,19.05 0 top
Q20  123.19,13.97 0 top
Q21  113.03,23.5 90 top
Q22  115.57,19.05 0 top
Q23  115.57,13.97 0 top
Q24  105.41,23.5 90 top
Q25  107.95,19.05 0 top
Q26  107.95,13.97 0 top
Q27  97.79,23.5 90 top
Q28  100.33,19.05 0 top
Q29  100.33,13.97 0 top
Q30  90.17,23.5 90 top
Q31  92.71,19.05 0 top
Q32  92.71,13.97 0 top
Q33  140.97,13.97 180 top
Q34  133.35,13.97 180 top
Q35  125.73,13.97 180 top
Q36  118.11,13.97 180 top
Q37  110.49,13.97 180 top
Q38  102.87,13.97 180 top
Q39  95.25,13.97 180 top
Q40  87.63,13.97 180 top
Q41  82.55,23.5 90 top
Q42  85.09,19.05 0 top
Q43  85.09,13.97 0 top
Q44  74.93,23.5 90 top
Q45  77.47,19.05 0 top
Q46  77.47,13.97 0 top
Q47  67.31,23.5 90 top
Q48  69.85,19.05 0 top
Q49  69.85,13.97 0 top
Q50  59.69,23.5 90 top
Q51  62.23,19.05 0 top
Q52  62.23,13.97 0 top
Q53  52.07,23.5 90 top
Q54  54.61,19.05 0 top
Q55  54.61,13.97 0 top
Q56  44.45,23.5 90 top
Q57  46.99,19.05 0 top
Q58  46.99,13.97 0 top
Q59  36.83,23.5 90 top
Q60  39.37,19.05 0 top
Q61  39.37,13.97 0 top
Q62  29.21,23.5 90 top
Q63  31.75,19.05 0 top
Q64  31.75,13.97 0 top
Q65  80.01,13.97 180 top
Q66  72.39,13.97 180 top
Q67  64.77,13.97 180 top
Q68  57.15,13.97 180 top
Q69  49.53,13.97 180 top
Q70  41.91,13.97 180 top
Q71  34.29,13.97 180 top
Q72  26.67,13.97 180 top
Q73  64.77,4.45 0 top
Q74  68.58,4.45 0 top
Q75  140.97,19.05 180 top
Q76  133.35,19.05 180 top
Q77  125.73,19.05 180 top
Q78  118.11,19.05 180 top
Q79  110.49,19.05 180 top
Q80  102.87,19.05 180 top
Q81  95.25,19.05 180 top
Q82  87.63,19.05 180 top
Q83  80.01,19.05 180 top
Q84  72.39,19.05 180 top
Q85  64.77,19.05 180 top
Q86  57.15,19.05 180 top
Q87  49.53,19.05 180 top
Q88  41.91,19.05 180 top
Q89  34.29,19.05 180 top
Q90  26.67,19.05 180 top
Q91  57.15,4.45 0 top
Q92  60.96,4.45 0 top
R1  13.34,10.16 180 top
R2  13.34,12.7 180 top
R3  13.34,17.78 180 top
R4  13.34,20.32 180 top
R5  13.34,25.4 180 top
R6  13.34,27.94 180 top
R7  13.34,33.02 180 top
R8  13.34,35.56 180 top
R9  143.51,26.04 180 top
R10  135.89,26.04 180 top
R11  128.27,26.04 180 top
R12  120.65,26.04 180 top
R13  113.03,26.04 180 top
R14  105.41,26.04 180 top
R15  97.79,26.04 180 top
R16  90.17,26.04 180 top
R17  82.55,26.04 180 top
R18  74.93,26.04 180 top
R19  67.31,26.04 180 top
R20  59.69,26.04 180 top
R21  52.07,26.04 180 top
R22  44.45,26.04 180 top
R23  36.83,26.04 180 top
R24  29.21,26.04 180 top
R25  73.66,4.45 0 top
R26  73.66,6.35 0 top
R27  13.34,7.62 180 top
R28  13.34,15.24 180 top
R29  13.34,22.86 180 top
R30  13.34,30.48 180 top
R31  143.51,30.48 0 top
R32  143.51,27.94 0 top
R33  135.89,29.84 0 top
R34  135.89,27.94 0 top
R35  128.27,29.84 0 top
R36  128.27,27.94 0 top
R37  120.65,29.84 0 top
R38  120.65,27.94 0 top
R39  113.03,29.84 0 top
R40  113.03,27.94 0 top
R41  105.41,29.84 0 top
R42  105.41,27.94 0 top
R43  97.79,29.84 0 top
R44  97.79,27.94 0 top
R45  90.17,29.84 0 top
R46  90.17,27.94 0 top
R47  82.55,29.84 0 top
R48  82.55,27.94 0 top
R49  74.93,29.84 0 top
R50  74.93,27.94 0 top
R51  67.31,29.84 0 top
R52  67.31,27.94 0 top
R53  59.69,29.84 0 top
R54  59.69,27.94 0 top
R55  52.07,29.84 0 top
R56  52.07,27.94 0 top
R57  44.45,29.84 0 top
R58  44.45,27.94 0 top
R59  36.83,29.84 0 top
R60  36.83,27.94 0 top
R61  29.21,29.84 0 top
R62  29.21,27.94 0 top
R63  51.44,5.71 0 top
R64  73.66,2.54 0 top
TP1  48.58,3.17 0 top
TP2  2.86,13.34 0 top
TP3  2.86,19.05 0 top
TP4  2.86,24.77 0 top
TP5  2.86,30.48 0 top
TP6  143.51,39.37 0 top
TP7  135.89,39.37 0 top
TP8  128.27,39.37 0 top
TP9  120.65,39.37 0 top
TP10  113.03,39.37 0 top
TP11  105.41,39.37 0 top
TP12  97.79,39.37 0 top
TP13  90.17,39.37 0 top
TP14  143.51,35.56 0 top
TP15  135.89,35.56 0 top
TP16  128.27,35.56 0 top
TP17  120.65,35.56 0 top
TP18  113.03,35.56 0 top
TP19  105.41,35.56 0 top
TP20  97.79,35.56 0 top
TP21  90.17,36.2 0 top
TP22  82.55,39.37 0 top
TP23  74.93,39.37 0 top
TP24  67.31,39.37 0 top
TP25  59.69,39.37 0 top
TP26  52.07,39.37 0 top
TP27  44.45,39.37 0 top
TP28  36.83,39.37 0 top
TP29  29.21,39.37 0 top
TP30  82.55,35.56 0 top
TP31  74.93,35.56 0 top
TP32  67.31,35.56 0 top
TP33  59.69,35.56 0 top
TP34  52.07,35.56 0 top
TP35  44.45,35.56 0 top
TP36  36.83,35.56 0 top
TP37  29.21,35.56 0 top

### Tracks (layer width: path | path; a pad name or v marks a point on that pad's centre or on a via)
+5V
  pour Route3: 1.27,41.91 152.72,41.91 152.72,1.27 1.27,1.27
D0  (via drill 0.5 pad 1.02)
  Top 0.406: Q66.G v73.66,9.53 | v58.42,9.53 Q68.G | Q70.G 43.18,11.75 42.23,10.79 v42.23,10.16 | Q34.G v134.62,10.16 | Q36.G 119.38,10.16 v118.75,9.53 | Q38.G v104.14,9.53 | Q40.G 88.9,11.43 87,9.53 v85.72,9.53 | Q72.G v27.94,10.16
  Bottom 0.406: v134.62,10.16 132.72,10.16 131.44,8.89 121.92,8.89 121.28,9.53 v118.75,9.53 v104.14,9.53 100.33,9.53 99.69,8.89 92.08,8.89 90.81,10.16 86.36,10.16 v85.72,9.53 84.45,9.53 83.82,10.16 74.93,10.16 v73.66,9.53 69.85,9.53 69.22,8.89 59.05,8.89 v58.42,9.53 57.78,10.16 v42.23,10.16 v27.94,10.16 | R2.1 Q2.D 19.05,12.7 20.32,13.97 Q72.G
D0_N
  Top 0.406: Q65.G 81.28,5.71 | 81.28,5.71 78.74,5.71 76.83,8.26 66.04,8.26 | Q71.G 35.56,12.06 34.61,11.11 29.53,11.11 28.89,10.48 28.89,7.62 | 28.89,7.62 50.8,7.62 | 50.8,7.62 Q69.G | 66.04,8.26 53.98,8.26 53.34,7.62 50.8,7.62 | 66.04,8.26 Q67.G | Q33.G 142.24,10.79 137.16,10.79 135.25,8.89 127,8.89 | Q37.G 111.76,6.99 | 111.76,6.99 96.52,6.99 | Q39.G 96.52,6.99 | 96.52,6.99 95.25,5.71 81.28,5.71 | Q35.G 127,8.89 | 127,8.89 123.19,8.89 121.28,6.99 111.76,6.99 | Q2.G 22.23,11.43 22.86,10.79 22.86,8.26 23.5,7.62 28.89,7.62
  Bottom 0.406: R1.1 15.88,8.89 | 15.88,8.89 R27.1 | 15.88,8.89 Q1.D 18.41,10.16 Q2.G
D1  (via drill 0.5 pad 1.02)
  Top 0.406: Q52.G v60.96,10.16 | v68.58,10.16 Q49.G | Q32.G 91.44,11.43 v92.71,10.16 | Q29.G v99.06,10.16 | Q17.G v129.54,10.16 | v123.19,10.16 121.92,11.43 Q20.G
  Bottom 0.406: Q61.G 40.01,13.97 40.64,13.34 40.64,11.43 | 40.64,11.43 45.09,11.43 46.35,10.79 59.69,10.79 v60.96,10.16 v68.58,10.16 69.22,10.79 91.44,10.79 92.08,10.16 v92.71,10.16 v99.06,10.16 99.69,10.79 121.92,10.79 122.56,10.16 v123.19,10.16 v129.54,10.16 | R4.1 Q4.D 19.05,20.32 20.32,21.59 21.59,21.59 22.86,20.32 22.86,17.14 23.5,16.51 27.94,16.51 Q64.G 32.38,13.97 33.02,13.34 33.02,11.43 40.64,11.43
D1_N  (via drill 0.5 pad 1.02)
  Top 0.406: Q58.G 45.72,11.75 43.5,9.53 v43.5,8.89 | v24.13,8.89 24.13,18.41 23.5,19.05 Q4.G
  Bottom 0.406: Q58.G 47.62,13.97 48.26,13.34 48.26,11.43 55.88,11.43 | 55.88,11.43 55.88,13.34 55.24,13.97 Q55.G | Q46.G 78.11,13.97 78.74,13.34 78.74,11.43 | 78.74,11.43 55.88,11.43 | Q43.G 85.72,13.97 86.36,13.34 86.36,11.43 | 86.36,11.43 78.74,11.43 | Q26.G 108.58,13.97 109.22,13.34 109.22,11.43 | 109.22,11.43 86.36,11.43 | Q11.G 146.69,13.97 147.32,13.34 147.32,11.43 139.7,11.43 | Q23.G 116.2,13.97 116.84,13.34 116.84,11.43 | 116.84,11.43 109.22,11.43 | Q14.G 139.06,13.97 139.7,13.34 139.7,11.43 | 116.84,11.43 139.7,11.43 | R28.1 15.88,16.51 | 15.88,16.51 R3.1 | 15.88,16.51 Q3.D 18.41,17.78 Q4.G | v43.5,8.89 v24.13,8.89
D2  (via drill 0.5 pad 1.02)
  Top 0.406: v52.07,15.24 v52.07,8.89 | v89.53,8.26 90.17,8.89 v90.17,15.24 | Q6.D 18.41,26.04 19.05,25.4 22.23,25.4 22.86,24.77 22.86,23.5 24.77,21.59 24.77,17.78 26.04,16.51 27.3,16.51 29.84,19.05 Q63.G
  Bottom 0.406: Q22.G 111.76,16.51 109.86,16.51 108.58,19.05 Q25.G 104.14,16.51 102.23,16.51 100.97,19.05 Q28.G 96.52,16.51 94.61,16.51 93.34,19.05 Q31.G 90.17,17.78 v90.17,15.24 | Q54.G 52.07,17.78 52.07,16.51 | 52.07,16.51 v52.07,15.24 | v52.07,8.89 52.7,8.26 74.93,8.26 76.2,9.53 80.01,9.53 81.92,7.62 87.63,7.62 88.27,8.26 v89.53,8.26 | R6.1 Q6.D | 52.07,16.51 48.9,16.51 47.62,19.05 Q57.G 43.18,16.51 41.27,16.51 40.01,19.05 Q60.G 35.56,16.51 33.66,16.51 32.38,19.05 Q63.G
D2_N  (via drill 0.5 pad 1.02)
  Top 0.406: v120.65,15.24 v120.65,8.26 | v82.55,8.89 82.55,17.78 Q42.G | Q51.G 58.42,21.59 53.34,21.59 52.7,20.95 51.44,20.95 50.8,21.59 45.72,21.59 45.09,20.95 43.81,20.95 43.18,21.59 38.1,21.59 37.47,20.95 36.2,20.95 35.56,21.59 30.48,21.59 29.84,20.95 28.57,20.95 26.04,23.5 25.4,23.5 23.5,25.4 23.5,26.04 22.86,26.67 Q6.G
  Bottom 0.406: Q51.G 62.87,19.05 64.14,16.51 66.04,16.51 Q48.G 70.48,19.05 71.75,16.51 73.66,16.51 Q45.G 78.11,19.05 79.38,16.51 81.28,16.51 Q42.G | v120.65,15.24 120.65,17.78 Q19.G 123.83,19.05 125.09,16.51 127,16.51 Q16.G 131.44,19.05 132.72,16.51 133.99,16.51 135.89,19.05 Q13.G 139.06,19.05 140.34,16.51 142.24,16.51 Q10.G | v120.65,8.26 91.44,8.26 90.17,9.53 87.63,9.53 87,8.26 83.82,8.26 83.19,8.89 v82.55,8.89 | R29.1 15.88,24.13 | 15.88,24.13 R5.1 | 15.88,24.13 Q5.D 18.41,25.4 Q6.G
D3
  Top 0.406: Q41.G Q44.G Q47.G Q50.G Q53.G Q56.G Q59.G Q62.G 29.21,24.13 28.57,24.77 25.4,24.77 24.77,25.4 24.77,28.57 22.86,29.84 22.86,32.38 22.23,33.02 19.05,33.02 18.41,33.66 Q8.D
  Bottom 0.406: R8.1 Q8.D
D3_N
  Top 0.406: Q9.G Q12.G Q15.G Q18.G Q21.G Q24.G Q27.G Q30.G 87,22.23 82.87,26.04 82.87,30.48 82.23,31.11 24.77,31.11 24.13,31.75 24.13,33.66 23.5,34.29 Q8.G
  Bottom 0.406: R30.1 15.88,31.75 | 15.88,31.75 R7.1 | 15.88,31.75 Q7.D 18.41,33.02 Q8.G
DIN0
  Bottom 0.406: TP2.P$1 8.89,13.34 10.16,11.43 12.7,11.43 13.34,10.79 13.34,6.35 13.97,5.71 17.78,5.71 Q1.G
DIN1
  Bottom 0.406: TP3.P$1 5.08,15.88 8.26,15.88 10.16,13.97 18.41,13.97 Q3.G
DIN2
  Bottom 0.406: TP4.P$1 4.45,21.59 18.41,21.59 Q5.G
DIN3
  Bottom 0.406: TP5.P$1 2.86,29.21 4.45,27.94 8.89,27.94 10.16,29.21 18.41,29.21 Q7.G
EN
  Bottom 0.406: Q92.D 62.23,4.45 Q73.G Q74.G 69.22,4.45 R64.1
EN_IN
  Bottom 0.406: TP1.P$1 49.53,3.17 50.8,1.91 55.24,1.91 55.88,2.54 Q91.G
EN_N
  Bottom 0.406: R63.1 50.16,6.99 55.88,6.99 Q91.D 58.42,4.45 Q92.G
GND
  pour Route2: 1.27,41.91 152.72,41.91 152.72,1.27 1.27,1.27
N$1
  Bottom 0.406: Q42.D 85.09,22.23 Q41.S
N$2
  Bottom 0.406: Q10.D 146.05,22.23 Q9.S
N$3
  Bottom 0.406: Q11.D Q10.S
N$4
  Bottom 0.406: Q13.D 138.43,22.23 Q12.S
N$5
  Bottom 0.406: Q14.D Q13.S
N$6
  Bottom 0.406: Q16.D 130.81,22.23 Q15.S
N$7
  Bottom 0.406: Q17.D Q16.S
N$8
  Bottom 0.406: Q19.D 123.19,22.23 Q18.S
N$9
  Bottom 0.406: Q20.D Q19.S
N$10
  Bottom 0.406: Q22.D 115.57,22.23 Q21.S
N$11
  Bottom 0.406: Q23.D Q22.S
N$12
  Bottom 0.406: Q25.D 107.95,22.23 Q24.S
N$13
  Bottom 0.406: Q26.D Q25.S
N$14
  Bottom 0.406: Q28.D 100.33,22.23 Q27.S
N$15
  Bottom 0.406: Q29.D Q28.S
N$16
  Bottom 0.406: Q31.D 92.71,22.23 Q30.S
N$17
  Bottom 0.406: Q32.D Q31.S
N$18
  Bottom 0.406: Q43.D Q42.S
N$19
  Bottom 0.406: Q33.D Q11.S
N$20
  Bottom 0.406: Q45.D 77.47,21.59 Q44.S
N$21
  Bottom 0.406: Q34.D Q14.S
N$22
  Bottom 0.406: Q35.D Q17.S
N$23
  Bottom 0.406: Q36.D Q20.S
N$24
  Bottom 0.406: Q37.D Q23.S
N$25
  Bottom 0.406: Q38.D Q26.S
N$26
  Bottom 0.406: Q39.D Q29.S
N$27
  Bottom 0.406: Q40.D Q32.S
N$28
  Bottom 0.406: Q46.D Q45.S
N$29
  Bottom 0.406: Q48.D 69.85,21.59 Q47.S
N$30
  Bottom 0.406: Q49.D Q48.S
N$31
  Bottom 0.406: Q51.D 62.23,21.59 Q50.S
N$32
  Bottom 0.406: Q52.D Q51.S
N$33
  Bottom 0.406: Q54.D 54.61,22.23 Q53.S
N$34
  Bottom 0.406: Q55.D Q54.S
N$35
  Bottom 0.406: Q57.D 46.99,22.23 Q56.S
N$36
  Bottom 0.406: Q58.D Q57.S
N$37
  Bottom 0.406: Q60.D 39.37,22.23 Q59.S
N$38
  Bottom 0.406: Q61.D Q60.S
N$39
  Bottom 0.406: Q63.D 31.75,21.59 Q62.S
N$40
  Bottom 0.406: Q63.S Q64.D
N$41
  Bottom 0.406: Q65.D Q43.S
N$42
  Bottom 0.406: Q66.D Q46.S
N$43
  Bottom 0.406: Q67.D Q49.S
N$44
  Bottom 0.406: Q68.D Q52.S
N$45
  Bottom 0.406: Q69.D Q55.S
N$46
  Bottom 0.406: Q70.D Q58.S
N$47
  Bottom 0.406: Q71.D Q61.S
N$48
  Bottom 0.406: Q72.D Q64.S
N$49  (via drill 0.5 pad 1.02)
  Top 0.406: Q33.S 140.97,16.51 133.35,16.51 | 133.35,16.51 125.73,16.51 | 125.73,16.51 118.11,16.51 | 118.11,16.51 110.49,16.51 | 110.49,16.51 102.87,16.51 | 102.87,16.51 95.25,16.51 | 95.25,16.51 87.63,16.51 Q40.S | 95.25,16.51 Q39.S 93.98,13.97 93.98,8.26 v92.71,6.99 | Q38.S 102.87,16.51 | Q37.S 110.49,16.51 | Q36.S 118.11,16.51 | Q35.S 125.73,16.51 | Q34.S 133.35,16.51 | Q73.D 66.04,6.99 68.9,6.99 70.48,5.4 70.48,5.08 R25.1
  Bottom 0.406: v92.71,6.99 91.44,5.71 79.06,5.71 78.11,4.76 78.11,2.54 76.83,1.27 74.3,1.27 R25.1
N$50  (via drill 0.5 pad 1.02)
  Top 0.406: 72.39,16.51 80.01,16.51 Q65.S 78.74,13.97 v78.74,8.26 | 72.39,16.51 64.77,16.51 | 64.77,16.51 57.15,16.51 | 57.15,16.51 49.53,16.51 | 49.53,16.51 41.91,16.51 | 41.91,16.51 34.29,16.51 | 34.29,16.51 29.21,16.51 27.94,15.24 Q72.S | Q69.S 49.53,16.51 | Q68.S 57.15,16.51 | Q66.S 72.39,16.51 | Q70.S 41.91,16.51 | Q67.S 64.77,16.51 | Q71.S 34.29,16.51
  Bottom 0.406: 71.12,7.62 70.48,7.62 Q74.D | 71.12,7.62 78.11,7.62 v78.74,8.26 | R26.1 71.12,7.62
N$51
  Bottom 0.406: R27.2 10.16,7.62 8.89,8.89 8.89,10.16 D1.K
N$52
  Bottom 0.406: R28.2 D2.K
N$53
  Bottom 0.406: R29.2 8.89,22.86 D3.K
N$54
  Bottom 0.406: R30.2 9.53,30.48 D4.K
N$55
  Bottom 0.406: D5.K 144.78,29.21 R32.2
N$56
  Bottom 0.406: D13.K 83.82,29.21 R48.2
N$57
  Bottom 0.406: D6.K 137.16,29.21 R34.2
N$58
  Bottom 0.406: D14.K 76.2,29.21 R50.2
N$59
  Bottom 0.406: D7.K 129.54,29.21 R36.2
N$60
  Bottom 0.406: D15.K 68.58,29.21 R52.2
N$61
  Bottom 0.406: D8.K 121.92,29.21 R38.2
N$62
  Bottom 0.406: D16.K 60.96,29.21 R54.2
N$63
  Bottom 0.406: D9.K 114.3,29.21 R40.2
N$64
  Bottom 0.406: D17.K 53.34,29.21 R56.2
N$65
  Bottom 0.406: D10.K 106.68,29.21 R42.2
N$66
  Bottom 0.406: D18.K 45.72,29.21 R58.2
N$67
  Bottom 0.406: D11.K 99.06,29.21 R44.2
N$68
  Bottom 0.406: D19.K 38.1,29.21 R60.2
N$69
  Bottom 0.406: D12.K 91.44,29.21 R46.2
N$70
  Bottom 0.406: D20.K 30.48,29.21 R62.2
N$71
  Bottom 0.406: D21.K R63.2
S0
  Bottom 0.406: TP6.P$1 140.97,36.83 R31.1 139.7,29.21 139.7,20 140.97,18.73 Q75.D
S0_N
  Bottom 0.406: Q75.G Q9.D 144.78,26.04 | R9.1 144.78,26.04 | TP14.P$1 143.51,27.94 | 143.51,27.94 143.51,27.3 144.78,26.04 | R32.1 143.51,27.94
S1
  Bottom 0.406: TP7.P$1 133.35,36.83 R33.1 132.08,28.57 132.08,20 133.35,18.73 Q76.D
S1_N
  Bottom 0.406: Q76.G Q12.D 137.16,26.04 | R10.1 137.16,26.04 | TP15.P$1 135.89,28.26 | 135.89,28.26 135.89,27.3 137.16,26.04 | R34.1 135.57,27.94 135.89,28.26
S2
  Bottom 0.406: TP8.P$1 125.73,36.83 R35.1 124.46,28.57 124.46,19.68 125.73,18.41 Q77.D
S2_N
  Bottom 0.406: Q77.G Q15.D 129.54,26.04 | R11.1 129.54,26.04 | TP16.P$1 128.27,27.94 | 128.27,27.94 128.27,27.3 129.54,26.04 | R36.1 128.27,27.94
S3
  Bottom 0.406: TP9.P$1 118.11,36.83 R37.1 116.84,28.57 116.84,19.68 118.11,18.41 Q78.D
S3_N
  Bottom 0.406: Q78.G Q18.D 121.92,26.04 | R12.1 121.92,26.04 | TP17.P$1 120.65,27.94 | 120.65,27.94 120.65,27.3 121.92,26.04 | R38.1 120.65,27.94
S4
  Bottom 0.406: TP10.P$1 110.49,36.83 R39.1 109.22,28.57 109.22,20 110.49,18.73 Q79.D
S4_N
  Bottom 0.406: Q79.G Q21.D 114.3,26.04 | R13.1 114.3,26.04 | TP18.P$1 113.03,27.94 | 113.03,27.94 113.03,27.3 114.3,26.04 | R40.1 113.03,27.94
S5
  Bottom 0.406: TP11.P$1 102.87,36.83 R41.1 101.6,28.57 101.6,20 102.87,18.73 Q80.D
S5_N
  Bottom 0.406: Q80.G Q24.D 106.68,26.04 | R14.1 106.68,26.04 | TP19.P$1 105.41,27.94 | 105.41,27.94 105.41,27.3 106.68,26.04 | R42.1 105.41,27.94
S6
  Bottom 0.406: TP12.P$1 95.25,36.83 R43.1 93.98,28.57 93.98,20 95.25,18.73 Q81.D
S6_N
  Bottom 0.406: Q81.G Q27.D 99.06,26.04 | R15.1 99.06,26.04 | TP20.P$1 97.79,28.26 | 97.79,28.26 97.79,27.3 99.06,26.04 | R44.1 97.47,27.94 97.79,28.26
S7
  Bottom 0.406: TP13.P$1 87.63,36.83 R45.1 86.36,28.57 86.36,20 87.63,18.73 Q82.D
S7_N
  Bottom 0.406: Q82.G Q30.D 91.44,26.04 | R16.1 91.44,26.04 | TP21.P$1 90.17,27.94 | 90.17,27.94 90.17,27.3 91.44,26.04 | R46.1 90.17,27.94
S8
  Bottom 0.406: TP22.P$1 80.01,36.83 R47.1 78.74,28.57 78.74,20 80.01,18.73 Q83.D
S8_N
  Bottom 0.406: Q83.G Q41.D 83.82,26.04 | R17.1 83.82,26.04 | TP30.P$1 82.55,27.94 | 82.55,27.94 82.55,27.3 83.82,26.04 | R48.1 82.55,27.94
S9
  Bottom 0.406: TP23.P$1 72.39,36.83 R49.1 71.12,28.57 71.12,20 72.39,18.73 Q84.D
S9_N
  Bottom 0.406: Q84.G Q44.D 76.2,26.04 | R18.1 76.2,26.04 | TP31.P$1 74.93,27.94 | 74.93,27.94 74.93,27.3 76.2,26.04 | R50.1 74.93,27.94
S10
  Bottom 0.406: TP24.P$1 64.77,36.83 R51.1 63.5,28.57 63.5,19.68 64.77,18.41 Q85.D
S10_N
  Bottom 0.406: Q85.G Q47.D 68.58,26.04 | R19.1 68.58,26.04 | TP32.P$1 67.31,27.94 | 67.31,27.94 67.31,27.3 68.58,26.04 | R52.1 67.31,27.94
S11
  Bottom 0.406: TP25.P$1 57.15,36.83 R53.1 56.83,29.84 55.88,28.89 55.88,20 57.15,18.73 Q86.D
S11_N
  Bottom 0.406: Q86.G Q50.D 60.96,26.04 | R20.1 60.96,26.04 | TP33.P$1 59.69,27.94 | 59.69,27.94 59.69,27.3 60.96,26.04 | R54.1 59.69,27.94
S12
  Bottom 0.406: TP26.P$1 49.53,36.83 R55.1 48.26,28.57 48.26,20 49.53,18.73 Q87.D
S12_N
  Bottom 0.406: Q87.G Q53.D 53.34,26.04 | R21.1 53.34,26.04 | TP34.P$1 52.07,27.94 | 52.07,27.94 52.07,27.3 53.34,26.04 | R56.1 52.07,27.94
S13
  Bottom 0.406: TP27.P$1 41.91,36.83 R57.1 40.64,28.57 40.64,20 41.91,18.73 Q88.D
S13_N
  Bottom 0.406: Q88.G Q56.D 45.72,26.04 | R22.1 45.72,26.04 | TP35.P$1 44.45,27.94 | 44.45,27.94 44.45,27.3 45.72,26.04 | R58.1 44.45,27.94
S14
  Bottom 0.406: TP28.P$1 34.29,36.83 R59.1 33.97,29.84 33.02,28.89 33.02,19.68 34.29,18.41 Q89.D
S14_N
  Bottom 0.406: Q89.G Q59.D 38.1,26.04 | R23.1 38.1,26.04 | TP36.P$1 36.83,28.26 | 36.83,28.26 36.83,27.3 38.1,26.04 | R60.1 36.51,27.94 36.83,28.26
S15
  Bottom 0.406: TP29.P$1 26.67,36.83 R61.1 26.35,29.84 25.4,28.89 25.4,19.05 Q90.D
S15_N
  Bottom 0.406: Q90.G Q62.D 30.48,26.04 | R24.1 30.48,26.04 | TP37.P$1 29.21,28.26 | 29.21,28.26 29.21,27.3 30.48,26.04 | R62.1 28.89,27.94 29.21,28.26

### Text on the board
tPlace: 15 | 14 | 13 | 12 | 11 | 10 | 9 | 8 | 7 | 6 | 5 | 4 | 3 | 2 | 1 | 0 | A3 | A2 | A1 | A0 | Decoder | Source | 4 to 16 Decoder (1) | James Newman | Enable | +5V | Gnd